# EasyEDA Pro project 3轴4.0控制板PCB源文件（LY-3X4.0-V2.0）.eprj, board LY-3axis-4.0-v2.0-
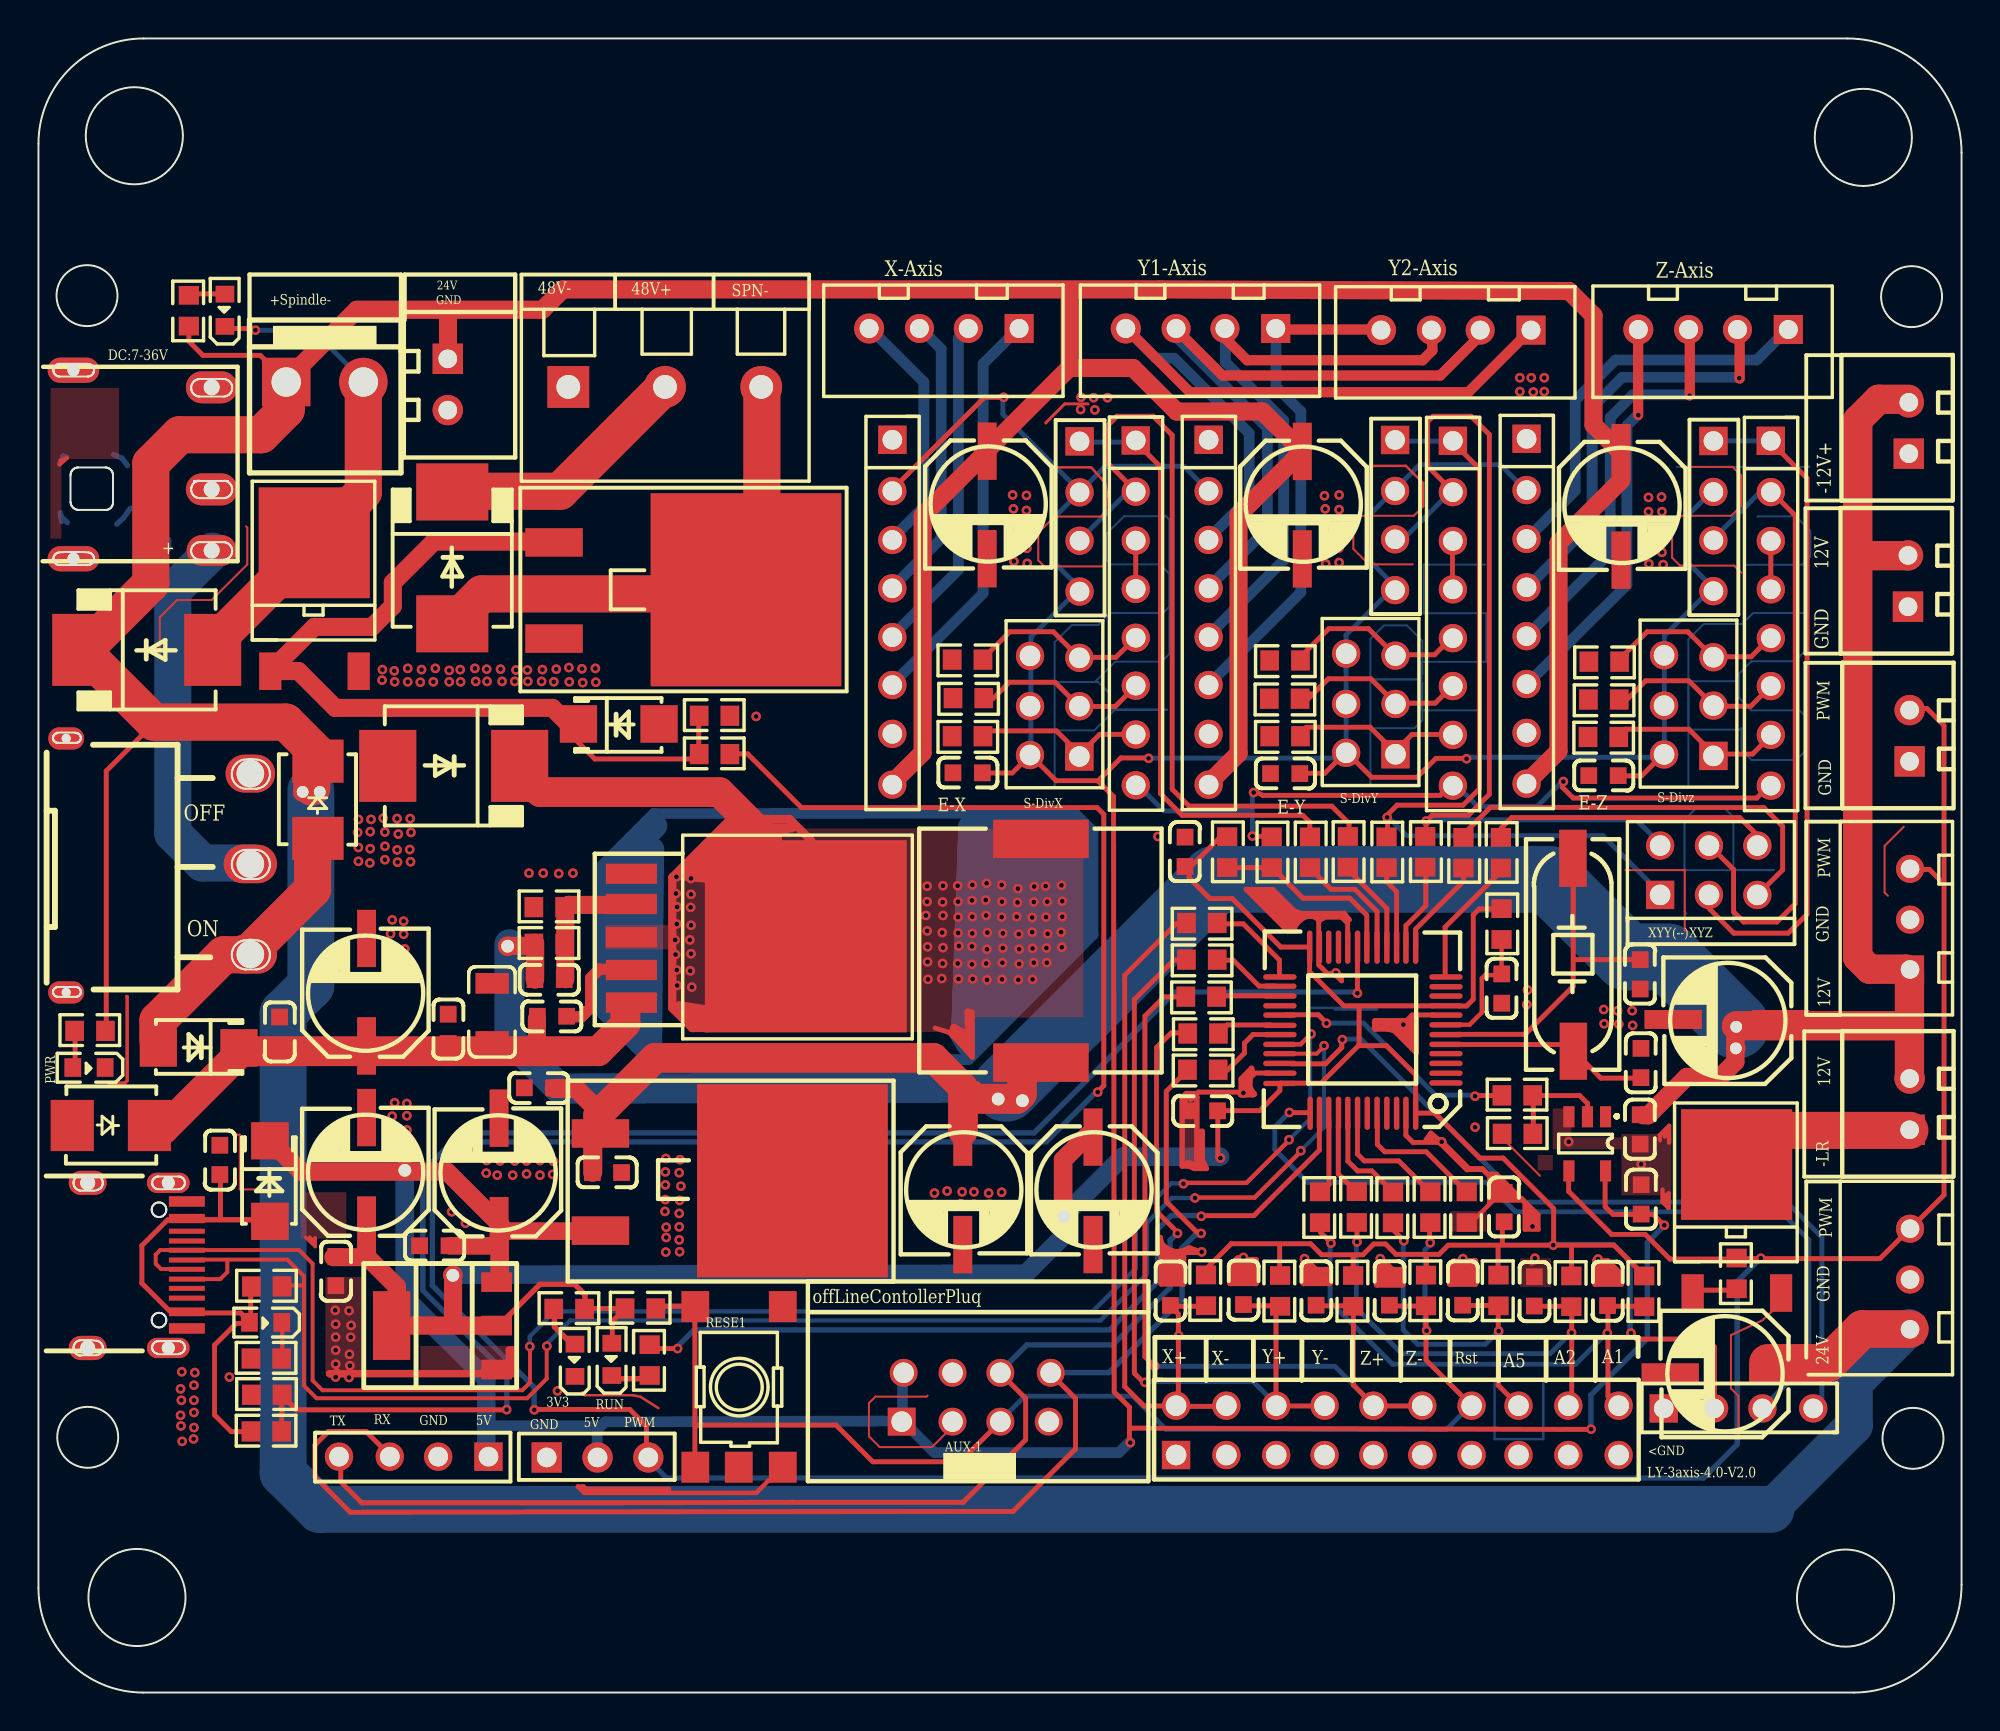
[diagram p0: board, top side]
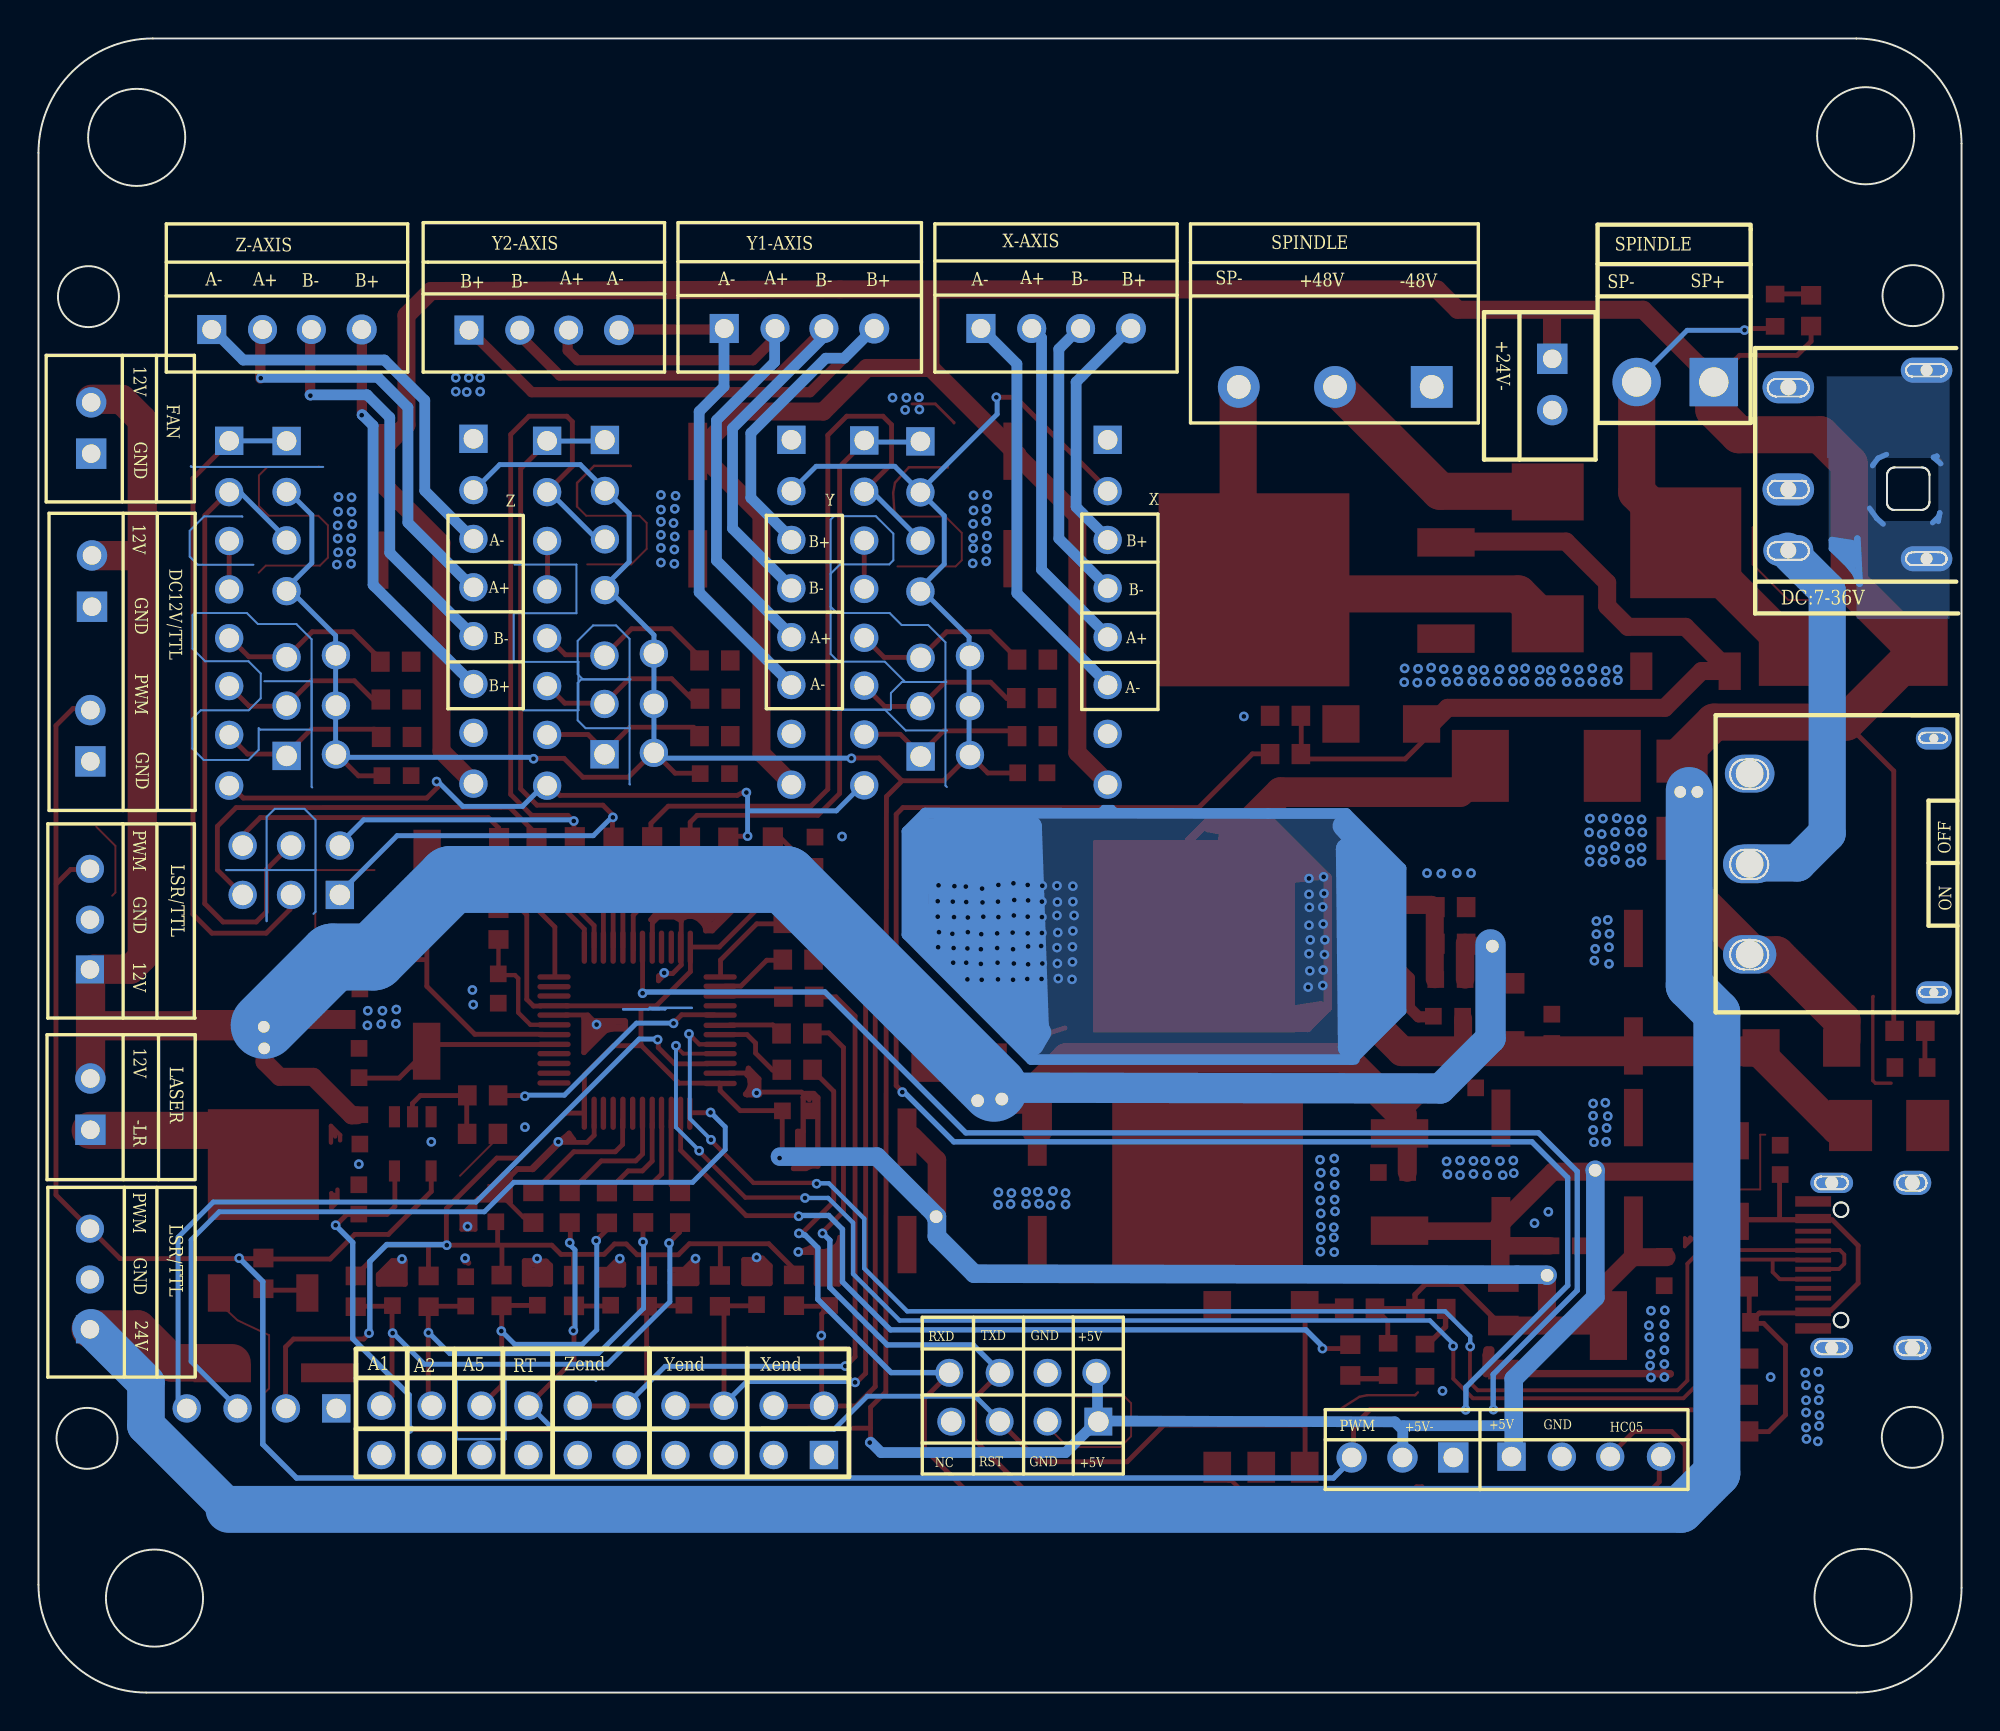
[diagram p1: board, bottom side, seen from below]

Outline 99.99 x 86.01 mm; copper layers: Top Layer, Bottom Layer. Coordinates in mm from the lower left corner of the outline.
Outline path: circle c2.52,72.64 r1.58 ; circle c2.56,13.27 r1.59 ; circle c4.98,80.95 r2.53 ; circle c5.12,4.94 r2.53 ; circle c6.27,25.11 r0.38 ; circle c6.27,19.36 r0.38 ; circle c93.96,4.91 r2.53 ; circle c94.88,80.87 r2.53 ; circle c97.39,72.59 r1.59 ; circle c97.47,13.22 r1.59 ; 0,80.54 arc(1.6,84.41) 5.47,86.01 94.04,86.01 arc(98.25,84.27) 99.99,80.06 99.99,5.6 arc(98.35,1.64) 94.39,0 5.44,0 arc(1.59,1.59) 0,5.44 0,80.54

## Placement (name value [footprint] x y rotation side)
NOREF  -  [Pad_ie8]  24.39 38.81 270 top
NOREF#2  -  [9]  97.31 24.12 0 top
NOREF#3  -  [9]  97.31 42.83 0 top
NOREF#4  -  [81]  81.48 29.94 0 top
NOREF#5  -  [8]  12.88 68.15 0 top
NOREF#6  -  [95]  9.01 67.87 0 top
NOREF#7  -  [76]  23.59 33.86 0 top
NOREF#8  -  [97]  11.02 47.78 0 top
NOREF#9  -  [Pad_ie10]  21.55 21.7 270 top
NOREF#10  -  [85]  12.03 24.5 0 top
NOREF#11  -  [85]  6.23 33.52 270 top
NOREF#12  -  [85]  32.27 50.37 90 top
NOREF#13  -  [88]  52.12 32.76 0 top
NOREF#14  -  [55]  73.18 31.7 0 top
NOREF#15  -  [82]  14.53 44.42 0 top
NOREF#16  -  [82]  1.76 29.48 270 top
NOREF#17  -  [2]  44.4 65.14 0 top
NOREF#18  -  [2]  57.05 65.11 0 top
NOREF#19  -  [2]  60.84 65.14 0 top
NOREF#20  -  [2]  73.54 65.09 0 top
NOREF#21  -  [2]  77.37 65.19 0 top
NOREF#22  -  [2]  90.07 65.09 0 top
NOREF#23  -  [83]  79.81 33.35 0 top
NOREF#24  -  [Pad_ie17]  14.63 46.83 270 top
NOREF#25  -  [6]  44.88 14.09 0 top
NOREF#26  -  [1]  84.51 14.77 180 top
NOREF#27  -  [1]  23.4 12.27 0 top
NOREF#28  -  [Pad_ie12]  88.25 33.5 270 top
NOREF#29  -  [4]  59.15 12.35 0 top
NOREF#30  -  [80]  12.67 21.11 0 top
NOREF#31  -  [80]  12.65 17.37 0 top
NOREF#32  -  [80]  12.67 15.48 0 top
NOREF#33  -  [80]  12.65 13.58 0 top
NOREF#34  -  [80]  28.39 19.95 0 top
NOREF#35  -  [80]  32.1 19.97 0 top
NOREF#36  -  [80]  31.78 18.09 90 top
NOREF#37  -  [80]  3.48 34.41 0 top
NOREF#38  -  [80]  27.36 38.94 0 top
NOREF#39  -  [80]  27.36 40.84 0 top
NOREF#40  -  [80]  35.95 50.79 0 top
NOREF#41  -  [80]  35.95 48.8 0 top
NOREF#42  -  [80]  7.82 72.65 90 top
NOREF#43  -  [80]  47.51 53.71 180 top
NOREF#44  -  [80]  47.55 51.71 180 top
NOREF#45  -  [80]  47.51 49.73 180 top
NOREF#46  -  [80]  64.02 53.67 180 top
NOREF#47  -  [80]  64 51.68 180 top
NOREF#48  -  [80]  64.02 49.73 180 top
NOREF#49  -  [80]  59.74 32.39 180 top
NOREF#50  -  [80]  59.75 34.27 180 top
NOREF#51  -  [80]  59.66 36.18 180 top
NOREF#52  -  [80]  59.69 38.11 180 top
NOREF#53  -  [80]  59.69 40.02 180 top
NOREF#54  -  [80]  61.81 42.91 270 top
NOREF#55  -  [80]  64.12 42.89 270 top
NOREF#56  -  [80]  66.11 42.89 270 top
NOREF#57  -  [80]  68.08 42.92 270 top
NOREF#58  -  [80]  70.09 42.89 270 top
NOREF#59  -  [80]  72.1 42.92 270 top
NOREF#60  -  [80]  74.09 42.87 270 top
NOREF#61  -  [80]  76.04 42.87 270 top
NOREF#62  -  [80]  76.07 39.16 270 top
NOREF#63  -  [80]  77.69 31.05 0 top
NOREF#64  -  [80]  77.7 29.05 0 top
NOREF#65  -  [80]  74.26 26.03 90 top
NOREF#66  -  [80]  72.37 26.03 90 top
NOREF#67  -  [80]  70.43 26.02 90 top
NOREF#68  -  [80]  68.55 26.05 90 top
NOREF#69  -  [80]  66.63 26.03 90 top
NOREF#70  -  [80]  60.71 21.72 90 top
NOREF#71  -  [80]  64.56 21.69 90 top
NOREF#72  -  [80]  68.36 21.69 90 top
NOREF#73  -  [80]  72.15 21.71 90 top
NOREF#74  -  [80]  75.91 21.71 90 top
NOREF#75  -  [80]  79.7 21.66 90 top
NOREF#76  -  [80]  83.49 21.66 90 top
NOREF#77  -  [80]  88.3 22.6 90 top
NOREF#78  -  [80]  80.57 49.69 180 top
NOREF#79  -  [80]  80.59 51.64 180 top
NOREF#80  -  [80]  80.61 53.6 180 top
NOREF#81  -  [77]  29.81 18.16 0 top
NOREF#82  -  [77]  27.9 18.12 0 top
NOREF#83  -  [77]  10.97 19.25 90 top
NOREF#84  -  [77]  1.79 32.5 90 top
NOREF#85  -  [77]  9.69 72.72 0 top
NOREF#86  -  [92]  29.22 29.07 0 top
NOREF#87  -  [94]  30.83 42.58 0 top
NOREF#88  -  [3]  84.24 41.48 270 top
NOREF#89  -  [5]  26.43 12.22 0 top
NOREF#90  -  [79]  27.46 35.17 0 top
NOREF#91  -  [79]  27.34 37.07 0 top
NOREF#92  -  [79]  26.79 31.44 0 top
NOREF#93  -  [79]  21.3 35.27 90 top
NOREF#94  -  [79]  12.54 35.13 90 top
NOREF#95  -  [79]  9.43 28.46 90 top
NOREF#96  -  [79]  15.46 22.68 90 top
NOREF#97  -  [79]  28.8 27.04 180 top
NOREF#98  -  [79]  19.82 23.23 180 top
NOREF#99  -  [79]  47.55 47.83 180 top
NOREF#100  -  [79]  64.06 47.78 180 top
NOREF#101  -  [79]  59.62 42.96 270 top
NOREF#102  -  [79]  80.61 47.68 180 top
NOREF#103  -  [79]  76.08 35.85 270 top
NOREF#104  -  [79]  83.28 36.59 270 top
NOREF#105  -  [79]  83.32 31.97 270 top
NOREF#106  -  [79]  83.28 28.52 270 top
NOREF#107  -  [79]  83.33 24.88 270 top
NOREF#108  -  [79]  76.21 24.48 270 top
NOREF#109  -  [79]  61.31 30.25 0 top
NOREF#110  -  [79]  58.85 21.65 90 top
NOREF#111  -  [79]  62.65 21.7 90 top
NOREF#112  -  [79]  66.43 21.66 90 top
NOREF#113  -  [79]  70.24 21.66 90 top
NOREF#114  -  [79]  74.05 21.66 90 top
NOREF#115  -  [79]  77.78 21.62 90 top
NOREF#116  -  [79]  81.59 21.64 90 top
NOREF#117  -  [Pad_ie14]  51.16 30.78 270 top
NOREF#118  -  [7]  21.28 66.69 0 top
NOREF#119  -  [7]  97.29 31.93 180 top
NOREF#120  -  [7]  97.29 51.09 180 top
NOREF#121  -  [7]  97.21 59.13 180 top
NOREF#122  -  [7]  97.25 67.09 180 top
NOREF#123  -  [93]  7.72 25.54 0 top
NOREF#124  -  [99]  83.18 70.88 0 top
NOREF#125  -  [99]  69.81 70.84 0 top
NOREF#126  -  [99]  56.54 70.93 0 top
NOREF#127  -  [99]  43.19 70.93 0 top
NOREF#128  -  [91]  26.81 59.81 0 top
NOREF#129  -  [98]  27.55 67.89 0 top
NOREF#130  -  [3#2]  87.09 48.7 0 top
NOREF#131  -  [3#2]  70.56 48.79 0 top
NOREF#132  -  [3#2]  54.12 48.67 0 top
NOREF#133  -  [86]  34.15 11.72 0 top
NOREF#134  -  [Pad_ie16]  13.74 46.83 270 top
NOREF#135  -  [87]  17.06 33.62 0 top
NOREF#136  -  [87]  23.95 24.28 0 top
NOREF#137  -  [87]  17.06 24.31 0 top
NOREF#138  -  [87]  48.06 28.88 180 top
NOREF#139  -  [87]  54.83 28.88 180 top
NOREF#140  -  [87]  90.43 16.63 90 top
NOREF#141  -  [87]  90.58 35 90 top
NOREF#142  -  [87]  82.29 64.47 180 top
NOREF#143  -  [87]  65.71 64.54 180 top
NOREF#144  -  [87]  49.33 64.55 180 top
NOREF#145  -  [90]  12.05 53.11 0 top
NOREF#146  -  [90]  86.01 20.78 0 top
NOREF#147  -  [Pad_ie9]  19.05 27.16 270 top
NOREF#148  -  [89]  9.06 54.22 90 top
NOREF#149  -  [89]  18.16 48.19 270 top
NOREF#150  -  [89]  21.52 55.57 0 top
NOREF#151  -  [Pad_ie11]  88.28 34.62 270 top
NOREF#152  -  [1]  87.09 65.05 90 top
NOREF#153  -  [1]  70.54 65.1 90 top
NOREF#154  -  [1]  54.13 65.02 90 top
NOREF#155  -  [Pad_ie15]  49.9 30.86 270 top
NOREF#156  -  [Pad_ie13]  53.32 24.74 270 top
NOREF#157  -  [84]  23.82 16.8 0 top

## Footprints (pads in the part's own frame, mm; a bottom-side part is the same pattern mirrored in y, then rotated)
1
  rect 1.473x1.473 hole 1.016: 1(0,0)
  round 1.473 hole 1.016: 2(-2.616,0) 3(-5.131,0) 4(-7.772,0)
2
  rect 1.473x1.473 hole 1.016: 1(0,0)
  round 1.473 hole 1.016: 2(0,-2.667) 3(0,-5.207) 4(0,-7.721) 5(0,-10.261) 6(0,-12.751) 7(0,-15.291) 8(0,-17.933)
3
  rect 1.473x1.473 hole 1.067: 1(0,0.076)
  round 1.473 hole 1.067: 2(-2.566,0.076) 3(0,2.616) 4(-2.566,2.616) 5(0,5.131) 6(-2.566,5.131)
3#2
  rect 1.473x1.473 hole 1.067: 1(0,0)
  round 1.473 hole 1.067: 2(-2.566,0.076) 3(0,2.616) 4(-2.566,2.616) 5(0,5.131) 6(-2.566,5.232)
4
  rect 1.473x1.473 hole 1.067: 1(0,0)
  round 1.473 hole 1.067: 2(0,2.566) 3(2.616,0) 4(2.616,2.566) 5(5.207,0) 6(5.207,2.566) 7(7.721,0) 8(7.721,2.566) 9(10.261,0) 10(10.261,2.566) 11(12.802,0) 12(12.802,2.566) 13(15.367,0) 14(15.367,2.566) 15(17.805,0) 16(17.805,2.566) 17(20.396,0) 18(20.396,2.566) 19(23.012,0) 20(23.012,2.566)
5
  rect 1.575x1.575 hole 1.016: 1(0,0)
  round 1.575 hole 1.016: 2(2.642,0) 3(5.283,0)
6
  rect 1.45x1.45 hole 1.067: 1(0,0)
  round 1.45 hole 1.067: 2(0.102,2.54) 3(2.642,0) 4(2.642,2.54) 5(5.131,0) 6(5.131,2.54) 7(7.646,0) 8(7.747,2.54)
7
  round 1.58 hole 0.965: 1(0,0)
  rect 1.58x1.58 hole 0.965: 2(0,2.667)
8
  rect 2.517x2.517 hole 1.524: 1(0,0)
  round 2.517 hole 1.524: 2(4.013,0)
9
  round 1.46 hole 0.96: 1(0,0) 2(0,-2.642)
  rect 1.46x1.46 hole 0.96: 3(0,-5.232)
55
  oval 1.731x0.28 smd: 1(0,0) 2(0,0.508) 3(0,1.016) 4(0,1.524) 5(0,2.006) 6(0,2.514) 7(0,3.022) 8(0,3.53) 9(0,4.013) 10(0,4.521) 11(0,5.004) 12(0,5.512) 25(-8.636,5.512) 26(-8.636,5.029) 27(-8.636,4.521) 28(-8.636,4.013) 29(-8.636,3.53) 30(-8.636,2.997) 31(-8.636,2.514) 32(-8.636,2.006) 33(-8.636,1.524) 34(-8.636,1.016) 35(-8.636,0.508) 36(-8.636,-0.025)
  oval 0.28x1.731 smd: 13(-1.575,7.061) 14(-2.083,7.061) 15(-2.566,7.061) 16(-3.074,7.061) 17(-3.582,7.061) 18(-4.115,7.061) 19(-4.598,7.061) 20(-5.106,7.061) 21(-5.588,7.061) 22(-6.096,7.061) 23(-6.579,7.061) 24(-7.087,7.061) 37(-7.061,-1.575) 38(-6.579,-1.575) 39(-6.096,-1.575) 40(-5.588,-1.575) 41(-5.106,-1.575) 42(-4.598,-1.575) 43(-4.09,-1.575) 44(-3.582,-1.575) 45(-3.074,-1.575) 46(-2.566,-1.575) 47(-2.083,-1.575) 48(-1.575,-1.575)
76
  rect 1.731x1.071 smd: 1(0,0) 2(0,3.022)
77
  rect 0.969x0.868 smd: 1(0,0) 2(0,-1.677)
79
  rect 0.868x0.868 smd: 1(0,0) 2(-1.524,0)
80
  rect 0.969x1.05 smd: 1(0,0) 2(-1.6,0)
81
  rect 0.578x1.1 smd: 1(0,0) 2(-0.94,0) 3(-1.905,0) 4(-1.905,-2.82) 5(0,-2.82)
82
  rect 2.66x2.239 smd: 1(0,0) 2(0,4.013)
83
  rect 1.427x2.965 smd: 1(0,0) 2(-0.025,10.033)
84
  rect 1.593x1.02 smd: 1(0,0) 2(0,2.286) 3(0,4.546)
  rect 1.935x3.575 smd: 4(-5.461,2.286)
85
  rect 1.949x1.935 smd: 1(0,0) 2(0,4.191)
86
  rect 1.441x1.609 smd: 1(0,0) 2(2.26,0) 3(4.546,0) 4(4.546,8.357) 5(0,8.357)
87
  rect 0.984x2.981 smd: 1(0,0) 2(0,5.588)
88
  rect 4.963x2 smd: 1(0,0) 2(0,11.633)
89
  rect 3.743x2.965 smd: 1(0,0) 2(0,6.858)
90
  rect 1.153x1.949 smd: 1(0,0) 3(4.598,0)
  rect 5.775x5.759 smd: 2(2.286,6.68)
91
  rect 2.984x1.479 smd: 1(0,0) 3(0,-5.004)
  rect 9.92x10.04 smd: 2(9.982,-2.464)
92
  rect 2.984x1.479 smd: 1(0,0) 3(0,-5.054)
  rect 9.92x10.04 smd: 2(9.982,-2.464)
93
  rect 1.867x0.545 smd: 1(0,0) 12(0,-6.604)
  rect 1.867x0.48 smd: 2(0,-0.889)
  rect 1.867x0.26 smd: 3(0,-1.55) 4(0,-2.058) 5(0,-2.54) 6(0,-3.048) 7(0,-3.53) 8(0,-4.038) 9(0,-4.521) 10(0,-5.029)
  rect 1.867x0.45 smd: 11(0,-5.74)
  oval 2.222x1.054 hole 0.675: 13(-0.965,0.965) 14(-0.965,-7.62)
  oval 1.968x1.257 hole 0.777: 15(-5.156,0.965) 16(-5.156,-7.62)
94
  rect 2.66x1.051 smd: 1(0,0) 2(0,-1.575) 3(0,-3.302) 4(0,-5.004) 5(0,-6.705)
  rect 10.5x10 smd: 6(9.068,-3.251)
95
  oval 2.679x1.663 hole 0.828: 1(0,0) 2(0,-5.309)
  oval 2.6x1.6 hole 0.828: 3(0,-8.483)
  oval 2.679x1.308 hole 0.625: 6(-7.188,0.889) 7(-7.188,-8.915)
97
  oval 2.578x1.968 hole 1.437: 1(0,0)
  oval 2.77x2 hole 1.437: 2(0,-4.699) 3(0,-9.398)
  oval 1.867x1.155 hole 0.472: 4(-9.576,1.829) 5(-9.576,-11.379)
98
  rect 2.171x2.171 hole 1.234: 1(0,0)
  round 2.171 hole 1.234: 2(5.029,0) 3(10.033,0)
99
  round 1.562 hole 0.98: 1(0,0)
  round 1.511 hole 0.98: 2(2.616,0) 3(5.156,0)
  rect 1.511x1.511 hole 0.98: 4(7.798,0)
Pad_ie8
  round 1.02 hole 0.66: 49(0,0)
Pad_ie9
  round 1.02 hole 0.66: 50(0,0)
Pad_ie10
  round 1.02 hole 0.66: 51(0,0)
Pad_ie11
  round 1.02 hole 0.61: 52(0,0)
Pad_ie12
  round 1.02 hole 0.61: 53(0,0)
Pad_ie13
  round 1.02 hole 0.66: 54(0,0)
Pad_ie14
  round 1.02 hole 0.66: 55(0,0)
Pad_ie15
  round 1.02 hole 0.66: 56(0,0)
Pad_ie16
  round 1.02 hole 0.61: 57(0,0)
Pad_ie17
  round 1.02 hole 0.61: 58(0,0)

## Nets
UNNAMEDNET1: NOREF#25.6 NOREF#27.4 NOREF#50.1
UNNAMEDNET2: NOREF#25.8 NOREF#27.3 NOREF#49.1
UNNAMEDNET3: NOREF#2.2 NOREF#3.2 NOREF#4.3 NOREF#6.1 NOREF#6.2 NOREF#6.6 NOREF#6.7 NOREF#7.2 NOREF#12.1 NOREF#14.8 NOREF#14.20 NOREF#14.23 NOREF#14.35 NOREF#14.47 NOREF#16.1 NOREF#17.1 NOREF#17.7 NOREF#19.1 NOREF#19.7 NOREF#21.1 NOREF#21.7 NOREF#25.3 NOREF#25.4 NOREF#26.1 NOREF#27.2 NOREF#29.1 NOREF#29.3 NOREF#29.5 NOREF#29.7 NOREF#29.9 NOREF#29.11 NOREF#29.13 NOREF#29.15 NOREF#29.17 NOREF#29.19 NOREF#31.2 NOREF#32.2 NOREF#39.2 NOREF#40.1 NOREF#43.1 NOREF#44.1 NOREF#45.1 NOREF#46.1 NOREF#47.1 NOREF#48.1 NOREF#64.2 NOREF#65.2 NOREF#78.1 NOREF#79.1 NOREF#80.1 NOREF#82.2 NOREF#84.2 NOREF#86.2 NOREF#87.1 NOREF#89.1 NOREF#92.2 NOREF#93.1 NOREF#94.1 NOREF#95.1 NOREF#96.2 NOREF#97.2 NOREF#98.1 NOREF#99.1 NOREF#100.1 NOREF#101.2 NOREF#102.1 NOREF#103.1 NOREF#104.1 NOREF#105.2 NOREF#106.1 NOREF#107.2 NOREF#108.2 NOREF#109.2 NOREF#110.1 NOREF#111.1 NOREF#112.1 NOREF#113.1 NOREF#114.1 NOREF#115.1 NOREF#116.1 NOREF#118.1 NOREF#120.2 NOREF#121.2 NOREF#122.2 NOREF#123.1 NOREF#123.12 NOREF#123.13 NOREF#123.14 NOREF#123.15 NOREF#123.16 NOREF#128.3 NOREF#129.1 NOREF#133.3 NOREF#133.4 NOREF#135.2 NOREF#136.2 NOREF#137.2 NOREF#138.2 NOREF#139.2 NOREF#140.2 NOREF#141.2 NOREF#142.2 NOREF#143.2 NOREF#144.2 NOREF#145.3 NOREF#146.3 NOREF#149.1 NOREF#157.1
UNNAMEDNET4: NOREF#4.5 NOREF#10.2 NOREF#17.2 NOREF#19.2 NOREF#21.2 NOREF#25.1 NOREF#25.2 NOREF#27.1 NOREF#86.3 NOREF#89.2 NOREF#98.2 NOREF#99.2 NOREF#100.2 NOREF#102.2 NOREF#107.1 NOREF#130.2 NOREF#130.4 NOREF#130.6 NOREF#131.2 NOREF#131.4 NOREF#131.6 NOREF#132.2 NOREF#132.4 NOREF#132.6 NOREF#136.1 NOREF#147.50 NOREF#152.2 NOREF#152.4 NOREF#153.2 NOREF#153.4 NOREF#154.2 NOREF#154.4 NOREF#157.3
UNNAMEDNET5: NOREF#14.34 NOREF#26.4
UNNAMEDNET6: NOREF#14.37 NOREF#26.3
UNNAMEDNET7: NOREF#9.51 NOREF#14.9 NOREF#14.24 NOREF#14.36 NOREF#14.48 NOREF#26.2 NOREF#34.1 NOREF#35.2 NOREF#54.2 NOREF#62.2 NOREF#70.1 NOREF#71.1 NOREF#72.1 NOREF#73.1 NOREF#74.1 NOREF#75.1 NOREF#76.1 NOREF#81.1 NOREF#96.1 NOREF#101.1 NOREF#108.1 NOREF#109.1 NOREF#137.1 NOREF#139.1 NOREF#156.54 NOREF#157.2 NOREF#157.4
UNNAMEDNET8: NOREF#2.1 NOREF#3.1 NOREF#4.4 NOREF#41.1 NOREF#77.1 NOREF#89.3 NOREF#120.1
UNNAMEDNET9: NOREF#22.2 NOREF#88.4 NOREF#152.3
UNNAMEDNET10: NOREF#22.1 NOREF#88.3 NOREF#152.1
UNNAMEDNET11: NOREF#20.2 NOREF#59.2 NOREF#88.2 NOREF#153.3
UNNAMEDNET12: NOREF#20.1 NOREF#58.2 NOREF#88.1 NOREF#153.1
UNNAMEDNET13: NOREF#18.2 NOREF#57.2 NOREF#154.3
UNNAMEDNET14: NOREF#18.1 NOREF#56.2 NOREF#154.1
UNNAMEDNET15: NOREF#2.3 NOREF#5.1 NOREF#15.2 NOREF#17.8 NOREF#19.8 NOREF#21.8 NOREF#24.58 NOREF#37.1 NOREF#42.2 NOREF#118.2 NOREF#134.57 NOREF#140.1 NOREF#142.1 NOREF#143.1 NOREF#144.1 NOREF#148.2
UNNAMEDNET16: NOREF#17.3 NOREF#127.1
UNNAMEDNET17: NOREF#17.4 NOREF#127.2
UNNAMEDNET18: NOREF#17.5 NOREF#127.3
UNNAMEDNET19: NOREF#17.6 NOREF#127.4
UNNAMEDNET20: NOREF#18.8 NOREF#20.8 NOREF#22.8 NOREF#55.2
UNNAMEDNET21: NOREF#18.3 NOREF#18.4
UNNAMEDNET22: NOREF#18.5 NOREF#43.2 NOREF#132.5
UNNAMEDNET23: NOREF#18.6 NOREF#44.2 NOREF#132.3
UNNAMEDNET24: NOREF#18.7 NOREF#45.2 NOREF#132.1
UNNAMEDNET25: NOREF#19.3 NOREF#125.4 NOREF#126.1
UNNAMEDNET26: NOREF#19.4 NOREF#125.3 NOREF#126.2
UNNAMEDNET27: NOREF#19.5 NOREF#125.2 NOREF#126.3
UNNAMEDNET28: NOREF#19.6 NOREF#125.1 NOREF#126.4
UNNAMEDNET29: NOREF#20.3 NOREF#20.4
UNNAMEDNET30: NOREF#20.5 NOREF#46.2 NOREF#131.5
UNNAMEDNET31: NOREF#20.6 NOREF#47.2 NOREF#131.3
UNNAMEDNET32: NOREF#20.7 NOREF#48.2 NOREF#131.1
UNNAMEDNET33: NOREF#21.3 NOREF#124.4
UNNAMEDNET34: NOREF#21.4 NOREF#124.3
UNNAMEDNET35: NOREF#21.5 NOREF#124.2
UNNAMEDNET36: NOREF#21.6 NOREF#124.1
UNNAMEDNET37: NOREF#22.3 NOREF#22.4
UNNAMEDNET38: NOREF#22.5 NOREF#80.2 NOREF#130.5
UNNAMEDNET39: NOREF#22.6 NOREF#79.2 NOREF#130.3
UNNAMEDNET40: NOREF#22.7 NOREF#78.2 NOREF#130.1
UNNAMEDNET41: NOREF#60.2 NOREF#88.5
UNNAMEDNET42: NOREF#61.2 NOREF#88.6
UNNAMEDNET43: NOREF#29.2 NOREF#29.4 NOREF#53.1 NOREF#70.2 NOREF#110.2
UNNAMEDNET44: NOREF#29.6 NOREF#29.8 NOREF#52.1 NOREF#71.2 NOREF#111.2
UNNAMEDNET45: NOREF#29.10 NOREF#29.12 NOREF#51.1 NOREF#72.2 NOREF#112.2
UNNAMEDNET46: NOREF#25.5 NOREF#29.14 NOREF#35.1 NOREF#66.2 NOREF#73.2 NOREF#113.2 NOREF#133.1 NOREF#133.5
UNNAMEDNET47: NOREF#29.16 NOREF#67.2 NOREF#74.2 NOREF#114.2
UNNAMEDNET48: NOREF#29.18 NOREF#68.2 NOREF#75.2 NOREF#115.2
UNNAMEDNET49: NOREF#29.20 NOREF#69.2 NOREF#76.2 NOREF#116.2
UNNAMEDNET50: NOREF#25.7
UNNAMEDNET51: NOREF#119.2 NOREF#146.2
UNNAMEDNET52: NOREF.49 NOREF#3.3 NOREF#13.1 NOREF#28.53 NOREF#38.2 NOREF#86.1 NOREF#91.2 NOREF#92.1 NOREF#97.1 NOREF#106.2 NOREF#117.55 NOREF#119.1 NOREF#121.1 NOREF#122.1 NOREF#138.1 NOREF#141.1 NOREF#151.52 NOREF#155.56
UNNAMEDNET53: NOREF#5.2 NOREF#85.2 NOREF#145.2 NOREF#148.1
UNNAMEDNET54: NOREF#128.2 NOREF#129.3 NOREF#150.1
UNNAMEDNET55: NOREF#129.2 NOREF#150.2
UNNAMEDNET56: NOREF#8.1
UNNAMEDNET57: NOREF#6.3 NOREF#8.2
UNNAMEDNET58: NOREF#8.3 NOREF#11.1 NOREF#15.1
UNNAMEDNET59: NOREF#8.4
UNNAMEDNET60: NOREF#8.5
UNNAMEDNET61: NOREF#10.1 NOREF#30.2 NOREF#33.2 NOREF#83.1 NOREF#95.2 NOREF#123.2 NOREF#123.11
UNNAMEDNET62: NOREF#123.3
UNNAMEDNET63: NOREF#123.4
UNNAMEDNET64: NOREF#14.32 NOREF#123.5 NOREF#123.7
UNNAMEDNET65: NOREF#14.33 NOREF#30.1 NOREF#123.6 NOREF#123.8
UNNAMEDNET66: NOREF#123.9
UNNAMEDNET67: NOREF#123.10
UNNAMEDNET68: NOREF#13.2 NOREF#87.3 NOREF#87.6 NOREF#149.2
UNNAMEDNET69: NOREF#7.1 NOREF#11.2 NOREF#16.2 NOREF#87.5 NOREF#90.2 NOREF#93.2 NOREF#94.2 NOREF#135.1
UNNAMEDNET70: NOREF#87.4 NOREF#90.1
UNNAMEDNET71: NOREF#38.1 NOREF#39.1 NOREF#87.2 NOREF#91.1
UNNAMEDNET72: NOREF#12.2 NOREF#40.2 NOREF#41.2 NOREF#128.1 NOREF#145.1
UNNAMEDNET73: NOREF#77.2 NOREF#146.1
UNNAMEDNET74: NOREF#133.2
UNNAMEDNET75: NOREF#14.5 NOREF#23.1 NOREF#105.1
UNNAMEDNET76: NOREF#14.6 NOREF#23.2 NOREF#104.2
UNNAMEDNET77: NOREF#4.1
UNNAMEDNET78: NOREF#4.2 NOREF#63.1 NOREF#64.1
UNNAMEDNET79: NOREF#31.1 NOREF#83.2
UNNAMEDNET80: NOREF#14.19 NOREF#32.1 NOREF#33.1
UNNAMEDNET81: NOREF#34.2 NOREF#82.1
UNNAMEDNET82: NOREF#14.38 NOREF#36.1
UNNAMEDNET83: NOREF#36.2 NOREF#81.2
UNNAMEDNET84: NOREF#37.2 NOREF#84.1
UNNAMEDNET85: NOREF#42.1 NOREF#85.1
UNNAMEDNET86: NOREF#14.31 NOREF#49.2
UNNAMEDNET87: NOREF#14.30 NOREF#50.2
UNNAMEDNET88: NOREF#14.27 NOREF#51.2
UNNAMEDNET89: NOREF#14.26 NOREF#52.2
UNNAMEDNET90: NOREF#14.25 NOREF#53.2
UNNAMEDNET91: NOREF#14.18 NOREF#54.1 NOREF#55.1
UNNAMEDNET92: NOREF#14.17 NOREF#56.1
UNNAMEDNET93: NOREF#14.16 NOREF#57.1
UNNAMEDNET94: NOREF#14.15 NOREF#58.1
UNNAMEDNET95: NOREF#14.14 NOREF#59.1
UNNAMEDNET96: NOREF#14.13 NOREF#60.1
UNNAMEDNET97: NOREF#14.12 NOREF#61.1
UNNAMEDNET98: NOREF#14.7 NOREF#62.1 NOREF#103.2
UNNAMEDNET99: NOREF#14.29 NOREF#63.2
UNNAMEDNET100: NOREF#14.44 NOREF#65.1
UNNAMEDNET101: NOREF#14.42 NOREF#66.1
UNNAMEDNET102: NOREF#14.41 NOREF#67.1
UNNAMEDNET103: NOREF#14.40 NOREF#68.1
UNNAMEDNET104: NOREF#14.39 NOREF#69.1
UNNAMEDNET105: NOREF#14.1
UNNAMEDNET106: NOREF#14.2
UNNAMEDNET107: NOREF#14.3
UNNAMEDNET108: NOREF#14.4
UNNAMEDNET109: NOREF#14.10
UNNAMEDNET110: NOREF#14.11
UNNAMEDNET111: NOREF#14.21
UNNAMEDNET112: NOREF#14.22
UNNAMEDNET113: NOREF#14.28
UNNAMEDNET114: NOREF#14.43
UNNAMEDNET115: NOREF#14.45
UNNAMEDNET116: NOREF#14.46

## Via types
v1: diameter 0.5, hole 0.25, Top Layer to Bottom Layer, 347 vias

## Routing (per net, layer and track width the routed paths; a pad name or vN(x,y) marks a point on that pad's centre or on a via; arc(x,y) is an arc through that point)
(no net): length 1.8
  Top Layer w0.174: 13.89,23.67 14.39,23.19 14.39,23.64 14.31,23.59 14.3,23.4 14.1,23.67 14.13,23.67
UNNAMEDNET1: length 67.6
  Top Layer w0.253: 49.95,16.44 50.19,16.44 51.33,15.29 51.33,13.14 48.08,9.9 39.21,9.9 29.74,9.86 16.81,9.86 15.72,10.95 15.72,11.9 ; 59.44,34.3 58.9,34.3 58.13,33.54 58.13,25.02 59.3,23.86
  Bottom Layer w0.278: 50.09,16.77 51.39,18.08 55.86,18.08 58.84,21.06 58.84,23.52 59.16,23.83 59.16,23.87
  vias: v1(59.22,23.88)
UNNAMEDNET2: length 73.3
  Top Layer w0.253: 18.16,12.57 18.03,12.57 17.03,13.58 15.08,13.58 14.37,12.87 14.37,11.22 16.21,9.38 50.28,9.42 50.67,9.42 53.92,12.67 53.92,15.29 52.81,16.4 ; 59.61,32.23 58.64,31.26 58.64,25.53 60.22,23.95 60.42,23.95
  Bottom Layer w0.278: 53.1,16.64 55.66,16.64 59.47,20.45 59.47,23.12 60.13,23.79 60.2,23.79 60.29,23.89
  vias: v1(60.45,23.88)
UNNAMEDNET3: length 503.2
  Top Layer w0.1: 96.99,45.02 95.99,44.03 95.99,41.6 96.16,41.43 ; 47.49,13.79 46.46,12.76 43.74,12.76 43.18,13.32 43.18,15.05 43.52,15.39 46.17,15.39 46.23,15.44 ; 85.42,63.76 85.45,63.73 88.08,63.73 88.53,63.29 88.53,61.7 88.02,61.19 85.44,61.19 84.94,60.7 84.94,59.01 85.35,58.6 88.17,58.6 88.54,58.23 ; 85.63,39.59 85.6,39.62 85.6,42.79 85.58,42.77 82.52,42.77 ; 71.46,58.66 69.17,58.66 68.37,59.47 68.37,60.82 68.74,61.19 71.51,61.19 71.99,61.67 ; 10.8,60.64 10.86,60.58 10.86,58.66 9.01,56.81 7.21,56.81 6.31,55.91 6.31,53.99 ; 55.33,58.56 52.3,58.56 51.98,58.88 51.98,60.3 52.83,61.15 55.26,61.15 55.27,61.16 ; 11.62,26.16 10.47,26.16 10.47,29.01 10.2,29.01 ; 88.4,13.38 88.39,13.39 88.39,15.42 88,15.81 88,18.58 89.64,19.36 90.4,20.07 ; 76.04,28.78 76.17,28.78 78.07,26.87
  Top Layer w0.126: 55.27,61.16 55.49,61.43 55.55,62.38 55.46,62.91 54.74,63.71 52.72,63.71 52.7,63.7 ; 28.27,15.61 28.42,15.46 30.9,15.46 31.31,15.38 32.24,14.78 ; 69.19,63.78 69.2,63.79 71.1,63.79 71.99,62.9 71.99,61.67
  Top Layer w0.149: 52.39,66.01 52.39,66.04 53.36,67.01 54.57,67.01
  Top Layer w0.174: 3.66,31.69 4.48,31.69 4.61,31.82 4.61,36.17 4.59,36.2
  Top Layer w0.2: 1.12,64.07 1.48,64.19 1.3,64.05 1.1,63.85
  Top Layer w0.202: 58.33,23.26 58.35,23.7 58.47,23.2 ; 59.02,21.65 59.34,21.37
  Top Layer w0.227: 74.7,24.71 74.77,24.71 75.88,25.82 ; 75.49,26.84 75.44,26.84 75.44,25.5 75.53,25.59 77.19,25.59 75.82,26.97 75.37,26.97 ; 84.56,28.91 84.67,29.23 ; 84.44,26.15 84.44,25.52 84.76,25.2 84.76,25.96 84.7,25.86 84.66,25.5 84.59,25.88 ; 84.31,28.71 84.31,28.99 84.78,29.46 84.78,28.6 ; 38.11,11.02 37.95,11.02 37.32,10.38 28.37,10.38 28.05,10.71 28.34,10.71 28.53,10.52 32.78,10.52 32.78,10.59 28.42,10.59 ; 76.97,25.71 77.12,25.71 77.99,24.84 77.99,24.08 77.28,24.08 77.28,25.46 77.53,25.06 ; 75.78,25.76 75.78,26.37 75.78,26.1 75.85,25.88 76.33,25.96 76.05,26.24 75.73,26.59 75.58,26.53 75.62,25.73 76.01,25.82 76.95,25.65 75.7,26.9 75.89,26.63 75.58,26.83
  Top Layer w0.253: 70.87,34.67 71.43,35.23 72.59,35.23 ; 71.1,29.53 71.1,28.98 71.47,28.61 72.95,28.61 72.72,28.82 72.4,29.09 72.16,28.75 72.54,28.78 72.64,28.77 72.38,28.89 ; 68.07,39.21 68.07,40 67.74,40.33 ; 66.45,40.26 66.26,40.35 65.98,40.35 65.7,40.24 65.44,39.98 65.33,39.8 65.3,39.6 64.95,39.6 62.79,41.76 64.18,41.76 65.28,40.66 65.55,40.55 ; 62.59,31.22 60.31,31.22 59.91,30.82 ; 62.99,32.22 64.06,32.22 ; 66.56,40.11 66.81,40.27 66.87,40.32 67.81,40.32 68.16,40.19 67.89,40.52 65.21,40.52 ; 67.53,37.3 67.71,37.3 67.75,37.25 67.75,37.01 67.37,37.39 67.01,37.39 66.57,37.84 66.57,40.31 ; 65.35,40.42 66.92,40.42 ; 66.95,40.43 67.73,40.43
  Top Layer w0.278: 60.16,31.15 59.68,31.15 59.47,30.94 59.47,27.38 59.82,27.38 60.09,27.25 60.73,27.25 60.52,27.69 60.52,29.18 60.23,29.18 60.23,30.96 59.63,30.96 59.63,30.71 ; 59.72,27.55 59.89,27.53 60.13,27.43 ; 62.88,31.31 62.83,31.31 62.74,31.36 62.73,31.51 62.86,32.1 62.76,31.88 62.65,31.54 62.77,31.21 62.54,31.17 62.54,31.91 63.08,32.46 63.15,32.12 63.03,32.01 62.98,31.76 62.98,31.53 63.11,31.25 63.22,31.11 63.15,31.08 62.52,31.08 62.48,31.11 ; 75.65,26.66 75.09,27.22 75.06,27.22 ; 60.23,29.09 60.23,27.71 60.34,27.39 60.39,27.39 60.39,27.83 60.29,29.05 ; 71.36,35.08 71.63,35.08 71.63,33.28 70.44,34.47 70.08,34.53 70.51,34.42
  Top Layer w0.303: 77.83,22.41 77.84,22.57 77.64,22.34 ; 62.62,22.57 62.36,22.57 61.97,22.18 61.97,21.28 63.3,21.28 63.3,22.5 62.65,22.5 62.31,22.31 62.09,21.81 62.22,21.46 63.05,21.52 63.08,22.27 62.52,22.16 62.45,22.13 62.6,22.17 ; 74.23,22.44 74.71,22.44 74.71,21.25 73.38,21.25 73.38,22.2 73.6,22.42 74.06,22.42 ; 81.65,21.67 81.34,22.07 81.29,22.38 81.87,21.92 82.08,21.5 81.14,21.55 81.12,22.44 81.59,22.44 82.3,21.73 82.3,21.25 80.94,21.25 80.94,22.46 81.09,22.46 ; 74.32,27.22 75.06,27.22 ; 74.13,22.25 74.46,22.24 74.43,21.55 73.64,21.48 73.56,22 73.85,22.26 73.99,22.15 74.17,21.78 74.43,21.4 74.07,21.59 ; 58.62,22.91 58.68,22.69 59.23,22.72 ; 66.53,21.82 66.53,21.88 65.83,22.57 65.78,22.57 65.78,21.28 67.14,21.28 67.14,21.98 66.01,21.98 65.98,22.25 65.99,21.8 66.95,21.69 66.92,21.54 66.61,21.43 66.04,21.51 66.02,21.7 ; 59.53,22.87 59.53,21.26 58.39,21.26 58.39,23.36 58.46,23.24 58.73,23.05 58.97,22.94 59.17,22.9 59.51,22.96 59.86,23.1 60.1,23 60.44,22.9 59.61,22.9 ; 69.8,22.44 69.74,22.44 69.59,22.28 69.59,21.21 70.92,21.21 70.92,21.98 70.39,21.98 69.86,22.51 69.83,22.3 69.83,21.38 70.69,21.41 70.73,21.67 70.72,21.73 70.16,21.63 70.14,21.66 69.92,22.14
  Top Layer w0.329: 74.28,27.25 74.32,27.22
  Top Layer w0.354: 70,34.58 71.06,34.58 71.06,34.54 69.51,34.54 69.51,34.89 71.19,34.89 71.19,34.85 ; 70.6,34.51 71.38,33.68 71.39,34.89 71.1,34.8 70.48,34.61 71.19,34.21 71.16,34.69 70.99,34.65 ; 65.12,40.5 65.46,40.34 65.02,39.79 63.16,41.56 64.08,41.56 65.09,40.46 65.18,40.15 63.6,41.25 63.81,41.33 64.39,40.98 64.57,40.75 ; 77.53,25.06 77.81,24.67 77.77,24.16 77.47,24.25 77.51,24.84 77.6,24.45
  Top Layer w0.38: 15.37,16.44 15.52,16.69 ; 72.82,28.67 72.87,28.67 74.28,27.25 ; 24.48,16.82 24.48,17.81 24.67,17.81 24.72,17.54 24.72,16.58 16.17,16.58 ; 15.38,16.58 15.14,16.57 16.21,16.57 16.16,16.4
  Top Layer w0.532: 58.71,22.5 59.13,22.57
  Top Layer w0.557: 59.13,22.57 59.15,21.63 58.7,21.67 58.58,22.29 58.89,21.95 59.17,21.64
  Bottom Layer w0.1: 85.69,40.49 85.59,40.6 85.59,45.38 86.16,45.95 87.7,45.95 88.11,45.55 88.13,45.53 88.13,40.11 88.13,42.77 90.22,42.77 85.57,42.77 ; 85.76,47.06 85.79,47.1 85.79,54.77 86.58,55.56 88.58,55.56 89.15,56.13 91.87,56.13 91.98,56.03 91.98,54.28 91.32,53.63 89.07,53.63 88.43,52.99 88.43,51.7 89.02,51.12 89.06,51.08 91.56,51.08 91.99,50.64 91.99,49.09 91.4,48.49 89.07,48.49 88.54,49.02 88.54,50.14 88.47,50.07 85.77,50.07 85.79,50.09 85.79,52.59 88.24,52.59 ; 89.39,61.14 89.41,61.16 91.38,61.16 92.13,60.41 92.13,59.07 91.7,58.64 88.82,58.64 ; 52.76,47.09 52.83,47.16 52.83,54.61 53.73,55.51 55.11,55.51 55.73,56.13 58.47,56.13 58.8,56.46 58.8,58.18 58.31,58.66 55.75,58.66 55.54,58.88 55.54,60.26 56.45,61.17 58.62,61.17 58.8,60.99 58.8,54.01 58.4,53.6 55.99,53.6 54.93,52.55 52.79,52.55 55.1,52.55 55.67,51.97 55.67,51.14 55.7,51.11 58.67,51.11 55.98,51.11 54.9,50.03 52.75,50.03 ; 75.24,58.65 72.02,58.65 72.02,56.12 75.28,56.12 75.28,53.59 71.91,53.59 71.91,51.08 74.78,51.08 74.82,51.12 ; 69.24,50.14 71.54,50.14 71.96,50.56 71.96,52.49 71.77,52.68 69.21,52.68 71.68,52.68 71.96,52.96 71.96,54.68 71.15,55.49 69.96,55.49 69.26,54.79 69.26,47.23 69.24,47.21 ; 85.18,63.73 92.03,63.73 92.06,63.76 92.08,63.75
  Bottom Layer w0.124: 78.27,16.3 78.24,16.3 78.24,13.18 75.71,13.18 75.71,16.22
  Bottom Layer w0.126: 68.07,35.53 67.42,35.53 67.39,35.55 67.68,35.55 ; 66.02,35.6 68.2,35.6 68.27,35.53 69.59,35.53 67.71,35.53
  Bottom Layer w0.149: 71,16.22 71.08,16.3 78.27,16.3
  Bottom Layer w0.278: 1.27,64.27 1.28,64.29 1.46,64.23 1.08,63.9 ; 1.5,60.83 1.19,61.15 1.13,61.34 1.21,60.9 ; 4.78,61.58 4.41,61.07 4.07,60.76 ; 3.91,64.38 4.34,64.19 4.59,63.85 4.62,63.8
  Bottom Layer w0.354: 5.42,60.01 5.3,57.67 5.51,58.2 5.88,58.66 6.73,59.49 6.73,59.92 5.72,59.76 5.55,58.67 6.55,59.59 6.44,59.62 5.92,59.4 5.76,59.01 6.06,59.69
  vias: v1(7.45,16.68) v1(7.39,15.79) v1(7.43,15.2) v1(7.39,14.41) v1(7.41,13.86) v1(7.47,13.06) v1(8.06,13.19) v1(8.13,16.64) v1(8.09,15.98) v1(8.09,15.2) v1(8.09,14.56) v1(8.09,13.78) v1(9.93,16.4) v1(15.43,19.88) v1(15.45,19.16) v1(15.45,18.48) v1(15.45,17.8) v1(15.45,17.08) v1(15.45,16.4) v1(16.15,19.85) v1(16.15,16.38) v1(16.26,19.09) v1(16.23,18.48) v1(16.17,17.59) v1(16.19,17) v1(16.64,45.4) v1(16.59,44.72) v1(16.64,43.94) v1(16.64,43.22) v1(17.25,44.77) v1(17.25,43.88) v1(17.23,43.14) v1(17.29,45.4) v1(17.86,52.64) v1(17.89,53.19) v1(17.93,45.47) v1(18.01,44.75) v1(18.01,44.01) v1(18.01,43.31) v1(18.31,39.45) v1(18.33,38.76) v1(18.33,37.89) v1(18.39,40.17) v1(18.39,29.97) v1(18.46,29.36) v1(18.5,53.13) v1(18.52,52.56) v1(18.52,30.67) v1(18.48,28.64) v1(18.65,45.45) v1(18.65,43.81) v1(18.71,44.64) v1(18.67,43.18) v1(18.99,40.11) v1(18.99,39.43) v1(19.05,38.67) v1(19.09,38.06) v1(19.16,30.63) v1(19.16,29.99) v1(19.16,29.25) v1(19.11,28.62) v1(19.2,53.26) v1(19.2,52.56) v1(19.33,45.45) v1(19.3,43.84) v1(19.35,43.2) v1(19.37,44.72) v1(19.85,52.54) v1(19.92,53.19) v1(20.53,52.56) v1(20.64,53.26) v1(21.36,53.15) v1(21.36,52.56) v1(21.48,25) v1(21.93,53.19) v1(21.95,52.56) v1(22.2,24.41) v1(22.69,53.26) v1(22.73,52.58) v1(23.3,53.21) v1(23.33,52.58) v1(23.3,27.67) v1(23.28,27.01) v1(23.85,26.9) v1(24.02,53.21) v1(24,27.64) v1(24.11,52.58) v1(24.66,26.9) v1(24.77,52.58) v1(24.77,27.64) v1(24.83,53.17) v1(25.42,53.17) v1(25.44,52.58) v1(25.38,27.64) v1(25.38,26.97) v1(25.51,42.61) v1(26.16,52.58) v1(26.08,27.67) v1(26.08,26.9) v1(26.2,53.19) v1(26.25,42.61) v1(26.73,26.95) v1(26.8,52.56) v1(26.78,27.62) v1(26.92,53.21) v1(27.05,42.59) v1(26.99,15.68) v1(27.58,53.3) v1(27.6,52.56) v1(27.79,42.61) v1(28.26,53.23) v1(28.3,52.51) v1(28.96,53.26) v1(28.98,52.54) v1(32.62,27.77) v1(32.6,27.07) v1(32.6,26.39) v1(32.6,25.63) v1(32.58,25.02) v1(32.64,24.19) v1(32.64,23.66) v1(32.62,22.9) v1(33.36,27.71) v1(33.32,27.03) v1(33.34,25.59) v1(33.32,24.91) v1(33.32,24.21) v1(33.32,23.54) v1(33.34,22.92) v1(33.4,26.33) v1(37.32,50.76) v1(46.59,25.97) v1(46.59,25.38) v1(47.24,26.08) v1(47.37,25.34) v1(47.96,25.42) v1(48.03,26.03) v1(48.64,26.03) v1(48.64,25.4) v1(49.4,25.97) v1(49.45,25.4) v1(50.08,26.01) v1(50.1,25.36) v1(50.65,62.27) v1(50.69,61.55) v1(50.71,60.92) v1(50.67,60.16) v1(50.69,59.48) v1(50.71,58.82) v1(51.37,62.25) v1(51.37,61.47) v1(51.39,60.77) v1(51.39,60.03) v1(51.39,59.5) v1(51.41,58.72) v1(54.21,67.35) v1(54.19,66.72) v1(54.86,67.33) v1(54.93,66.7) v1(55.58,67.33) v1(58.21,44.51) v1(60.48,22.91) v1(62.65,31.18) v1(62.65,22.63) v1(65.83,22.56) v1(66.87,62.23) v1(66.91,61.55) v1(66.91,60.11) v1(66.93,59.44) v1(66.93,58.7) v1(66.97,60.81) v1(67.46,37.42) v1(67.63,62.27) v1(67.63,61.51) v1(67.63,60.88) v1(67.63,60.2) v1(67.63,59.52) v1(67.63,58.76) v1(69.77,22.56) v1(70.97,34.73) v1(72.96,28.64) v1(74.06,22.56) v1(74.7,29.4) v1(77.03,68.37) v1(77.03,67.65) v1(77.43,36.53) v1(77.39,35.77) v1(77.62,68.37) v1(77.72,67.63) v1(77.68,24.24) v1(77.81,22.58) v1(78.3,68.37) v1(78.3,67.65) v1(79.57,28.64) v1(81.09,22.54) v1(81.39,35.52) v1(81.41,34.78) v1(82.11,35.45) v1(82.17,34.76) v1(82.87,35.45) v1(82.89,34.69) v1(83.33,27.47) v1(83.71,62.15) v1(83.71,61.4) v1(83.67,60.75) v1(83.73,60.03) v1(83.73,59.33) v1(83.73,58.7) v1(84.39,62.17) v1(84.41,61.4) v1(84.43,60.69) v1(84.43,60.01) v1(84.41,59.29) v1(84.48,58.65)
UNNAMEDNET4: length 269.5
  Top Layer w0.253: 65.88,47.81 66.89,47.81 67.84,48.76 ; 49.04,47.82 50.63,47.82 51.42,48.61 51.72,48.61 52.92,47.41 55.08,47.41 55.9,46.59 55.9,46.52 55.93,15.63 56.73,14.84 56.73,13.11 ; 74.19,48.58 72.67,48.58 71.68,47.59 69.32,47.59 68.21,48.7 ; 57.57,48.6 56.28,48.6 55.14,47.46 ; 50.2,67.35 49.19,67.35 44.69,62.85 44.69,62.76 ; 84.29,48.6 83.35,47.67 82.34,47.67 ; 84.55,24.32 84.5,24.32 83.96,24.86 83.4,24.86 ; 56.74,13.75 79.11,13.68 80.67,13.68 ; 81.46,26.89 81.46,25.27 81.87,24.86 83.02,24.86 83.08,24.92
  Top Layer w0.913: 24.06,24.02 24.06,24.28 ; 21.4,23.23 23.65,23.23 ; 24.19,23.99 28.8,23.99
  Top Layer w0.938: 12.3,28.44 13.65,27.08 21.25,27.08 24.06,24.28
  Top Layer w0.964: 23.96,21.65 23.98,21.67 23.98,23.66
  Bottom Layer w0.253: 57.81,48.59 67.66,48.59 67.99,48.92 67.99,54.99 70.43,57.44 70.43,57.64 69.28,58.79 69.28,61.31 71.82,63.85 76.01,63.85 77.3,62.56 ; 53.91,62.61 53.91,62.71 50.14,66.47 50.14,67.25 ; 74.42,48.63 83.88,48.63 84.54,49.29 84.54,54.96 87.02,57.44 87.02,57.5 85.78,58.74 85.78,61.23 86.83,62.28 86.94,62.28 ; 60.73,62.59 59.55,63.76 55.47,63.76 52.9,61.19 52.9,58.67 54.04,57.53 54.04,57.32 51.6,54.89 51.6,48.87
  Bottom Layer w0.278: 80.72,13.75 80.72,15.47 83.65,18.4 83.65,23.4 84.52,24.27
  Bottom Layer w0.557: 44.53,14.22 44.43,14.12 29.46,14.08 29.05,13.66 29.05,12.44 ; 23.67,13.88 29.04,13.88 29.07,13.84 ; 56.72,13.02 56.18,12.48 46.59,12.48 44.93,14.14 44.93,16.65
  Bottom Layer w0.964: 19.04,27.08 19.04,20.55 23.28,16.31 23.28,12.77 23.31,12.74
  vias: v1(50.19,67.35) v1(56.77,13) v1(57.72,48.58) v1(74.25,48.56) v1(80.73,13.69) v1(84.54,24.3)
UNNAMEDNET5: length 41.4
  Top Layer w0.253: 65.18,32.69 66.92,32.69 67.77,33.54 67.77,34.07
  Bottom Layer w0.253: 67.86,33.98 68.76,33.98 77.24,25.51 90.9,25.51 92.73,23.67 92.73,15.08 92.58,14.93
  vias: v1(67.8,33.95)
UNNAMEDNET6: length 42
  Top Layer w0.253: 65.25,30.15 66.04,30.15
  Bottom Layer w0.253: 89.94,15.11 89.95,15.11 92.05,17.22 92.05,23.54 90.59,25 76.8,25 75.27,26.53 65.98,26.53 64.28,28.23 64.28,29.41 64.97,30.1
  vias: v1(65.05,30.16)
UNNAMEDNET7: length 173
  Top Layer w0.253: 72.17,21.75 72.17,22.7 ; 79.71,21.75 79.71,23.21 ; 71.71,30.13 72.59,30.13 74.93,27.79 76.16,27.79 78.78,25.17 78.78,23.36 ; 28.61,19.97 30.42,19.97 ; 75.87,40.75 74.91,40.75 74.6,40.44 74.6,36.05 74.25,35.7 73.87,35.7 ; 76.11,23.33 76.11,24.36 ; 68.67,33.7 68.66,33.71 68.66,35.63 ; 60.61,21.93 62.02,23.34 66.15,23.34 66.72,22.77 68.87,22.77 69.43,23.33 70.04,23.33 70.58,22.79 72.82,22.79 73.3,23.26 81.92,23.26 83.42,21.76 83.48,21.76 ; 66.02,38.77 64.59,38.77 62.07,41.29 60.91,41.29 59.83,42.36 59.83,42.86 61.38,44.42 61.76,44.42 ; 75.89,21.86 75.89,23.16 ; 24.09,19.44 24.29,19.44 ; 61.39,27.73 61.32,27.8 61.32,30.12 61.46,30.26 63.5,30.26 64.55,31.31 64.55,31.66 64.58,31.69 66.69,31.69 68.63,33.63 70.09,33.63 71.61,32.12 71.61,30.15 ; 30.41,19.88 29.83,19.3 29.83,18.57 ; 87.14,14.65 87.14,17.97 86.73,18.38 83.08,18.38 82.83,18.64 82.8,18.64 ; 68.36,21.89 68.36,22.67 ; 64.54,21.76 64.54,23.25 ; 66.09,38.62 66.09,37.49 67.87,35.71 72.55,35.71
  Top Layer w0.278: 24.29,19.44 26.08,21.23 27.88,21.23 28.42,20.69 28.42,20.2
  Top Layer w0.938: 15.33,22.64 17.1,22.64 18.64,21.1 18.64,19.52 19.07,19.08 23.45,19.08 ; 17.05,22.68 17.05,22.92 ; 21.56,19.4 21.56,21.55
  Top Layer w0.964: 53.28,24.91 53.28,27.7 54.54,28.96
  Bottom Layer w0.278: 82.76,18.71 82.76,22.42 81.88,23.29 78.83,23.29
  Bottom Layer w0.964: 21.69,21.73 23.1,21.73 51.34,21.78 53.28,23.72 53.28,24.75 56.39,27.87 61.44,27.87
  vias: v1(61.46,27.79) v1(78.76,23.26) v1(82.8,18.69)
UNNAMEDNET8: length 211
  Top Layer w0.253: 88.58,22.56 95.75,22.56 97.5,24.32 97.53,24.32 99.08,25.88 99.08,50.28 98.19,51.17 97.79,51.17 ; 79.57,26.98 79.57,26.06 81.8,23.82 83.54,23.82 84.83,22.54 88.03,22.54 ; 36.34,48.81 36.87,48.81 39.67,46.02 55.04,46.02 55.39,45.67 55.39,31.56 55.09,31.25 ; 25.86,14.72 30.74,14.72 31.61,13.85 31.61,12.46 ; 97.58,42.8 98.32,42.8 99.07,42.05
  Bottom Layer w0.278: 25.77,14.8 25.77,15.88 20.48,21.17 20.48,26.78 22.34,28.64 52.4,28.64 54.98,31.22 55.05,31.22 ; 89.47,22.51 88.33,21.37 88.33,12.91 86.57,11.16 32.66,11.16 32.06,11.76 32.06,11.87
  vias: v1(25.78,14.7) v1(55.08,31.22) v1(89.56,22.58)
UNNAMEDNET9: length 32.7
  Top Layer w0.253: 87.03,43.8 87.13,43.8 88.14,42.8 88.14,40.6 88.67,40.07 90.39,40.07 91.34,41.02 91.34,61.2 90.28,62.27
  Bottom Layer w0.253: 87.23,60.13 89.42,62.33 89.81,62.33
UNNAMEDNET10: length 33.8
  Top Layer w0.253: 90.46,64.71 90.46,64.64 91.96,63.14 91.96,40.47 90.97,39.49 88.15,39.49 86.91,40.72 86.91,41.19
  Bottom Layer w0.253: 87.6,65.09 90.14,65.09
UNNAMEDNET11: length 47.4
  Top Layer w0.253: 73.42,62.58 72.23,63.76 72.23,66.08 72.52,66.37 74.49,66.37 75.44,65.42 75.44,46.7 74.35,45.61 72.46,45.61 72.23,45.38 ; 72.15,44.46 72.15,45.23
  Bottom Layer w0.253: 84.22,44.24 83.08,45.38 72.26,45.38 ; 73.13,62.34 73.13,62.15 70.44,59.46
  vias: v1(72.16,45.32)
UNNAMEDNET12: length 42.2
  Top Layer w0.253: 70.15,44.59 70.15,45.47 ; 70.08,45.58 70.64,46.14 74.07,46.14 74.92,46.99 74.92,63.64 73.99,64.57 73.92,64.57
  Bottom Layer w0.253: 70.94,65.08 73.17,65.08 ; 70.11,45.58 71.14,44.56 81.34,44.56 84.11,41.79 84.11,41.75
  vias: v1(70.12,45.51)
UNNAMEDNET13: length 39.8
  Top Layer w0.253: 68.15,44.7 68.15,45.19 67.25,46.09 59.83,46.09 58.95,46.97 58.95,65.38 57.96,66.37 56.08,66.37 55.64,65.92 55.64,63.89 56.67,62.85 56.76,62.85
  Bottom Layer w0.253: 56.76,62.56 54.38,60.18 54.38,60.05
UNNAMEDNET14: length 29.6
  Top Layer w0.253: 57.35,64.73 58.33,63.74 58.33,46.75 59.47,45.61 65.74,45.61 66.1,45.25 66.1,44.77
  Bottom Layer w0.253: 54.26,65.02 56.62,65.02
UNNAMEDNET15: length 353.8
  Top Layer w0.253: 12.02,68.91 12.02,69.05 11.54,69.53 8.55,69.53 7.82,70.26 7.82,70.93 ; 5.61,50.01 3.52,47.92 3.52,34.51
  Top Layer w0.938: 53.61,72.71 53.61,68.9 49.09,64.37 49.09,64.3 45.97,61.19 45.97,48.87 44.51,47.41 ; 77.41,47.33 79.04,48.96 79.04,59.77 82.27,63.01 82.27,64.5 80.86,65.91 80.86,71.61 79.59,72.88 58.31,72.96 27.26,72.96 26.2,71.9 16.55,71.9 13.06,68.41 ; 21.29,69.91 21.29,71.75 ; 53.85,68.9 53.87,68.88 56.92,68.88 59.18,66.61 63.65,66.61 65.49,64.77 65.49,64.33 62.4,61.23 62.4,48.83 61.02,47.46
  Top Layer w1.929: 14.62,48.59 14.62,48.72 12.87,50.46 6,50.46 2.49,53.97 2.49,54.31 5.84,57.67 5.84,63.9 7.34,65.41 11.58,65.41 12.88,66.71 12.88,68.08 ; 14.21,47.09 14.21,48.41
  Top Layer w1.954: 89.93,17.14 93.08,17.14 94.84,18.9 97.3,18.9
  Bottom Layer w1.954: 90.04,9.53 94.4,13.89 94.4,16.11 97.26,18.97
  Bottom Layer w2.437: 90.08,9.53 14.61,9.53 12.72,11.41 12.72,35.33 14.16,36.77 14.16,46.91
UNNAMEDNET16: length 12.4
  Bottom Layer w0.557: 43.41,70.7 43.49,70.7 46.04,68.15 46.04,61.65 44.48,60.09
UNNAMEDNET17: length 14.7
  Bottom Layer w0.557: 44.57,57.53 44.57,57.64 46.94,60.01 46.94,69.86 45.95,70.84
UNNAMEDNET18: length 17.1
  Bottom Layer w0.557: 44.63,55.18 47.84,58.39 47.84,70.44 48.14,70.75 48.24,70.75
UNNAMEDNET19: length 20.8
  Bottom Layer w0.557: 50.89,70.87 49.12,69.09 49.12,57.16 44.63,52.67 44.63,52.62
UNNAMEDNET20: length 36.5
  Top Layer w0.253: 73.29,47.06 72.88,46.65 63.66,46.65 63.28,46.86 ; 89.86,47.03 89.34,46.51 79.8,46.51 79.25,47.06 79.25,47.28 ; 63.29,44.52 63.62,44.52
  Bottom Layer w0.253: 63.12,44.66 63.12,46.73 ; 73.71,47.25 73.71,47.19 74.82,46.08 77.92,46.08 79.2,47.35 ; 57.46,46.94 57.46,46.89 58.5,45.85 63.02,45.85
  vias: v1(63.12,44.53) v1(63.18,46.8) v1(79.29,47.37)
UNNAMEDNET21: length 2.1
  Top Layer w0.253: 57.05,57.35 57.05,59.47
UNNAMEDNET22: length 8.6
  Top Layer w0.253: 57,54.81 56.02,53.83 54.69,53.83 ; 49.15,53.81 50.5,55.16 52.77,55.16 53.8,54.13 53.8,53.9
UNNAMEDNET23: length 7.8
  Top Layer w0.253: 54.74,51.28 55.99,51.28 56.87,52.17 ; 53.87,51.52 52.85,52.54 50.48,52.54 49.64,51.69 49.35,51.69
UNNAMEDNET24: length 8
  Top Layer w0.253: 49.46,50.01 52.93,50.01 54.07,48.86 54.22,48.86 55.18,49.83 56.61,49.83
UNNAMEDNET25: length 37.9
  Top Layer w0.532: 77.47,70.7 77.43,70.7 74.35,67.62 59.87,67.62 56.9,70.59
  Bottom Layer w0.557: 60.84,60.02 62.95,62.12 62.95,65.49 59.05,69.38 58.1,69.38 56.77,70.72 56.77,70.89
UNNAMEDNET26: length 34.2
  Top Layer w0.532: 59.28,70.82 59.28,70.77 61.56,68.48 72.89,68.48 74.99,70.59
  Bottom Layer w0.557: 58.84,70.8 63.9,65.74 63.9,60.53 60.95,57.57 60.9,57.57
UNNAMEDNET27: length 31
  Top Layer w0.532: 61.54,70.58 62.84,69.28 71.97,69.28 72.47,69.79 72.47,70.58
  Bottom Layer w0.557: 60.82,54.95 64.74,58.86 64.74,66.16 61.71,69.18 61.71,70.56
UNNAMEDNET28: length 25
  Top Layer w0.532: 64.68,70.88 69.51,70.88
  Bottom Layer w0.557: 61.14,52.73 61.15,52.73 65.64,57.21 65.64,66.61 64.35,67.9 64.35,70.51
UNNAMEDNET29: length 1.7
  Top Layer w0.253: 73.52,57.78 73.52,59.47
UNNAMEDNET30: length 8.9
  Top Layer w0.253: 65.84,54 65.84,54.07 67.09,55.32 69.15,55.32 70.51,53.96 72.59,53.96 73.31,54.68
UNNAMEDNET31: length 8.8
  Top Layer w0.253: 65.93,51.94 66.11,51.94 ; 73.29,52 73.17,52 72.62,51.45 70.55,51.45 69.28,52.72 67.07,52.72 65.91,51.56
UNNAMEDNET32: length 7.9
  Top Layer w0.253: 65.92,50.2 69.24,50.2 70.29,49.14 70.74,49.14 71.42,49.82 73.09,49.82
UNNAMEDNET33: length 20.1
  Bottom Layer w0.557: 77.52,60.17 77.58,60.17 79.9,62.49 79.9,67.19 82,69.29 89.34,69.29 90.58,70.53
UNNAMEDNET34: length 21.5
  Top Layer w0.532: 88.46,68.33 88.46,70.81
  Bottom Layer w0.557: 88.38,68.39 82.35,68.39 80.78,66.82 80.78,60.83 77.43,57.48
  vias: v1(88.43,68.35)
UNNAMEDNET35: length 20.8
  Top Layer w0.532: 85.86,67.46 85.86,70.61
  Bottom Layer w0.557: 77.62,54.96 77.62,55.18 81.72,59.27 81.72,66.3 82.9,67.48 85.87,67.48
  vias: v1(85.85,67.44)
UNNAMEDNET36: length 20.5
  Top Layer w0.532: 83.17,66.44 83.17,70.71
  Bottom Layer w0.557: 83.16,66.45 82.59,65.88 82.59,57.59 82.52,57.52 77.52,52.57 77.51,52.57
  vias: v1(83.18,66.42)
UNNAMEDNET37: length 2
  Top Layer w0.253: 90.07,57.63 90.07,59.58
UNNAMEDNET38: length 8.5
  Top Layer w0.253: 89.67,54.48 89.05,53.86 87.06,53.86 85.76,55.16 83.64,55.16 82.48,54 82.44,54
UNNAMEDNET39: length 8.5
  Top Layer w0.253: 87.5,51.29 89.03,51.29 89.89,52.15 90.07,52.15 ; 87.01,51.48 86.94,51.48 85.81,52.61 83.57,52.61 82.4,51.45
UNNAMEDNET40: length 7.7
  Top Layer w0.253: 87.79,48.8 89.12,48.8 89.92,49.59 ; 86.88,49.01 86.88,49.02 85.81,50.09 82.53,50.09 82.24,49.81
UNNAMEDNET41: length 21.3
  Top Layer w0.253: 89.49,41.7 89.61,41.7 90.69,42.78 90.69,45.04 89.71,46.02 75.96,46.03 75.49,46.03 74.21,44.75
UNNAMEDNET42: length 14.5
  Top Layer w0.253: 89.67,44.28 88.46,45.5 76.6,45.5 76.06,44.96 76.06,44.75
UNNAMEDNET43: length 37.5
  Top Layer w0.253: 59.07,20.09 60.56,20.09 ; 61.62,14.88 59.26,14.88 59.3,14.92 59.27,14.95 59.27,19.69 58.91,20.05 ; 59.38,39.98 59.16,39.98 56.48,37.31 56.48,15.91 57.49,14.9 58.97,14.9
  vias: v1(59.29,18.56)
UNNAMEDNET44: length 39.2
  Top Layer w0.253: 64.2,20.11 62.79,20.11 62.75,20.07 ; 66.67,14.92 66.65,14.9 64.61,14.9 64.35,15.17 64.35,19.72 ; 59.71,38.09 59.03,38.09 56.98,36.04 56.98,16.61 56.99,16.59 57.45,16.14 57.5,16.14
  Bottom Layer w0.253: 57.57,16.17 63.16,16.17 64.16,15.18
  vias: v1(57.53,16.13)
UNNAMEDNET45: length 41.8
  Top Layer w0.253: 59.41,36.17 58.53,36.17 57.53,35.18 57.53,17.46 58,17 ; 71.69,14.9 69.46,14.9 68.37,15.99 68.37,19.82 ; 66.81,20.11 68.22,20.11
  Bottom Layer w0.253: 58.13,16.97 67.4,16.97 69.23,15.15 69.45,15.15
  vias: v1(58.04,16.98)
UNNAMEDNET46: length 64.6
  Top Layer w0.253: 70.57,20.1 71.96,20.1 ; 72.34,23.54 72.34,24.25 ; 74.35,15.17 74.27,15.17 72.15,17.29 72.15,19.91 ; 34.23,13.86 34.27,13.91 41.48,13.91 43.38,12 47.93,12 49.62,13.69 ; 34.13,12.14 34.13,19.59
  Top Layer w0.278: 32.48,20.09 33.63,20.09 34.13,19.59
  Bottom Layer w0.253: 72.09,18.85 72.09,23.02 72.28,23.21 72.28,23.31 ; 50.19,14.21 50.19,14.31 51.29,15.41 56.9,15.41 58.62,13.68 73.22,13.68 74.45,14.92
  vias: v1(72.18,18.82) v1(72.37,23.39)
UNNAMEDNET47: length 17.9
  Top Layer w0.253: 76.89,15.05 76.82,15.05 75.9,15.97 75.9,20.1 ; 70.34,24.16 70.91,23.59 ; 74.08,20.13 75.7,20.13
  Bottom Layer w0.253: 70.96,23.46 70.96,18.86 71.71,18.11 75.23,18.11 75.81,18.69
  vias: v1(70.99,23.5) v1(75.92,18.8)
UNNAMEDNET48: length 23.2
  Top Layer w0.253: 79.72,15.12 79.72,19.94 ; 78.04,20.09 79.62,20.09 ; 68.56,23.53 68.56,24.36
  Bottom Layer w0.253: 68.53,23.39 68.53,19.98 70.89,17.62 78.6,17.62 79.63,18.65 79.7,18.65
  vias: v1(68.56,23.43) v1(79.71,18.71)
UNNAMEDNET49: length 27
  Top Layer w0.253: 81.61,19.94 81.61,15.4 81.86,15.15 81.86,15.13 ; 67.18,23.44 67.15,23.44 66.66,23.93 66.66,24.37 ; 81.68,20.09 83.08,20.09
  Bottom Layer w0.253: 67.16,23.41 67.16,20.32 70.41,17.07 79.92,17.07 81.53,18.68 81.57,18.68
  vias: v1(67.2,23.37) v1(81.58,18.69)
UNNAMEDNET51: length 8.1
  Top Layer w1.903: 89.43,28.6 90.06,29.23
  Top Layer w1.929: 90.06,29.23 97.3,29.23
UNNAMEDNET52: length 169.8
  Top Layer w0.938: 83.43,30.01 83.7,30.01 85.7,32.01 87.45,32.01 88.23,32.8 88.23,34.29 ; 24.51,38.83 25.66,38.83 25.81,38.98
  Top Layer w0.964: 25.81,37.08 25.81,38.98
  Top Layer w0.989: 29.07,30.22 29.07,30.29 27.95,31.41 26.82,31.41 ; 28.78,28.69 28.82,28.65 28.82,27.05
  Top Layer w1.522: 97.24,67.25 95.67,67.25 94.59,66.17 94.59,38.23 95.21,37.61 97.11,37.61 97.28,37.44 97.28,32.05 ; 95.1,59.12 96.99,59.12 ; 88.29,34.67 96.77,34.67
  Top Layer w1.548: 48.44,31.08 48.5,31.08 ; 48.43,30.87 50.88,30.87 51.13,31.11 51.13,32.03 ; 29.1,29.42 29.1,30.05 32.06,33 46.54,33 48.07,31.46 48.07,29.21
  Bottom Layer w1.573: 50.31,31.45 27.09,31.41 24.49,34.02 24.49,38.9
  Bottom Layer w3.478: 50.3,31.42 61.16,42.28 78.55,42.28 82.58,38.25 84.7,38.25 88.25,34.69
UNNAMEDNET53: length 19.9
  Top Layer w0.253: 10.2,70.93 11.27,70.93
  Top Layer w1.929: 9.4,54.59 9.4,54.86 12.93,58.4 ; 16.89,67.82 16.89,62.42 15.54,61.07 15.54,60.98
  Bottom Layer w0.253: 16.61,68.5 14.27,70.83 11.43,70.83
  vias: v1(11.28,70.84)
UNNAMEDNET54: length 19.6
  Top Layer w1.929: 33.8,56.96 33.63,57.13 23.05,57.13 21.84,55.92 ; 37.66,60.75 37.61,60.79 37.61,67.78
UNNAMEDNET55: length 12.1
  Top Layer w1.929: 22.46,62.59 22.58,62.46 27.11,62.46 32.32,67.67
UNNAMEDNET57: length 20.4
  Bottom Layer w1.929: 9.04,59.35 6.98,57.3 6.98,44.68 8.53,43.14 11.2,43.14
UNNAMEDNET58: length 14.2
  Top Layer w1.929: 6.21,33.94 6.21,34.95 9.63,38.36 10.85,38.36 14.26,41.77 14.26,43.98
  Top Layer w1.954: 14.26,43.98 14.31,44.04
UNNAMEDNET61: length 24.8
  Top Layer w0.253: 8.45,24.58 6.72,24.58 5.38,23.24 5.38,21.28 6.8,19.85 6.91,19.85 ; 9.46,24.66 9.46,26.92 ; 11.04,20.71 11.04,19.35 10.89,19.2 10.29,19.2 9.15,18.07 9.15,14.44 10.02,13.57 10.74,13.57 ; 10.69,19.56 10.51,19.74 8.19,19.74
  Top Layer w0.278: 8.45,24.58 11.37,24.58
UNNAMEDNET64: length 82.5
  Top Layer w0.202: 7.27,22.02 6.37,22.02 6.1,22.3 6.1,22.78 6.33,23.01 13.55,23.01 14.26,22.3 14.26,16.22 14.76,15.72 25.16,15.72 25.56,16.12 25.56,17.92
  Top Layer w0.227: 59.69,26.48 59.71,26.5 62.81,26.5 64.99,28.68 ; 65.16,33.71 65.63,33.71 66.12,34.21
  Bottom Layer w0.202: 66.12,34.32 66.12,29.84 65.09,28.81 65.09,28.8
  Bottom Layer w0.227: v1(25.55,17.99) 25.55,18.52 26.85,19.82 54.82,19.82 57.05,22.06 57.05,24.64 58.9,26.48 59.46,26.48
  vias: v1(59.53,26.46) v1(65.02,28.74) v1(66.17,34.25)
UNNAMEDNET65: length 81.6
  Top Layer w0.202: 8.42,21.5 9.45,21.5 9.82,21.86 9.82,22.42 ; 66.82,33.58 66.46,33.22 65.06,33.22 ; 8.42,22.51 12.94,22.51 13.8,21.65 13.8,15.96 14.46,15.3 25.41,15.3 26.43,16.32 26.43,17.89 ; 12.86,21.17 13.73,21.17
  Top Layer w0.227: 65.53,28.04 63.24,25.74 60.25,25.74
  Bottom Layer w0.202: 66.84,33.67 66.84,29.39 65.64,28.18 65.64,28.16
  Bottom Layer w0.227: 26.48,18.13 26.48,18.18 27.64,19.35 55.21,19.35 57.64,21.77 57.64,24.43 58.93,25.72 59.95,25.72
  vias: v1(26.44,18.01) v1(60.13,25.72) v1(65.64,28.17) v1(66.84,33.63)
UNNAMEDNET68: length 260.4
  Top Layer w0.253: 48.33,35.39 48.51,35.39 ; 48.56,35.39 48.56,33.03 47.9,33.77 47.34,34.33 46.62,34.55
  Top Layer w0.38: 48.33,35.39 48.4,33.47
  Top Layer w0.43: 33.27,42.47 34.88,42.3 34.69,42.74 33.57,42.63 34.68,43.66 34.61,43 34.18,42.81 35.35,44.37 36.17,44.96 35.97,44.99 38.98,44.99 39.17,44.95 36.66,44.47 35.7,44.26 36.33,44.76 36.47,44.58 ; 34.94,34.86 34.17,34.86 33.37,35.67 34.62,35.2 34.37,35.25 34.66,35.53 33.32,35.74 ; 48.4,33.47 47.6,34.54 48,34.32 48.09,34.14 ; 34.83,34.55 33.99,34.55 32.96,35.59 32.96,42.39 35.99,45.42 39.05,45.42 40.16,44.31 40.16,44.06
  Top Layer w1.548: 37.89,44.34 35.41,46.82 26.1,46.82 25.67,47.24
  Bottom Layer w0.253: 44.83,45.82 44.62,46.03 44.14,46.03 43.92,45.8
  Bottom Layer w0.557: 31.57,32.92 31.61,33.07 ; 31.53,33.07 29.15,35.45 29.15,42.86 31.99,45.71 36.05,45.71 53.88,45.73 54.83,44.78 54.83,39.41 48.37,32.91 31.73,32.91 31.59,33.05
  Bottom Layer w1.141: 53.4,40.41 48.03,34.67 48.39,45.02 53.78,44.89 54.14,44.45 54.33,39.88 48.28,33.7 47.9,34.33 ; 32.13,45.06 29.87,42.57 29.78,35.81 31.86,33.55 31.96,43.86 31.07,43.24 31.05,35.35 30.35,36.13 30.88,42.4
  Bottom Layer w1.319: 53.02,44.11 53.09,40.45
  Bottom Layer w1.37: 49.25,44.43 50.29,43.05 48.92,41.23 49.45,43.96 51.24,43.94 50.86,41.13 48.37,39.22 51.86,43.88 52.24,43.88 48.66,38.23 52.18,40.24 48.66,36.58 51.71,40.41 53.02,44.11
  vias: v1(33.15,41.55) v1(33.1,39.14) v1(33.13,38.38) v1(33.17,42.42) v1(33.21,40.85) v1(33.19,39.96) v1(33.19,37.57) v1(33.21,36.77) v1(33.87,39.14) v1(33.93,42.33) v1(33.93,41.51) v1(33.91,40.83) v1(33.93,39.9) v1(33.93,38.42) v1(33.89,37.53) v1(33.97,36.68) v1(46.14,40.41) v1(46.21,41.93) v1(46.21,41.13) v1(46.21,39.6) v1(46.23,38.78) v1(46.23,37.99) v1(46.25,37.08) v1(47.03,41.95) v1(47.01,41.11) v1(47.03,40.41) v1(46.99,39.52) v1(47.03,38.73) v1(47.01,37.91) v1(46.97,37.13) v1(47.79,41.95) v1(47.82,41.13) v1(47.82,40.32) v1(47.82,39.5) v1(47.86,38.82) v1(47.79,37.91) v1(47.84,37.11) v1(48.56,41.99) v1(48.54,41.19) v1(48.56,40.34) v1(48.56,39.48) v1(48.54,38.8) v1(48.54,37.87) v1(48.58,37.11) v1(49.25,41.21) v1(49.3,42.08) v1(49.28,40.41) v1(49.34,39.52) v1(49.32,38.65) v1(49.28,37.91) v1(49.32,37.06) v1(50.08,41.99) v1(50.1,41.13) v1(50.08,40.32) v1(50.14,39.48) v1(50.14,38.71) v1(50.12,37.95) v1(50.1,37.08) v1(50.86,40.34) v1(50.93,41.8) v1(50.91,41.08) v1(50.95,37.06) v1(50.97,39.43) v1(50.99,38.65) v1(50.99,37.89) v1(51.75,41.11) v1(51.67,40.3) v1(51.67,39.54) v1(51.69,38.69) v1(51.75,37.95) v1(51.69,37.08) v1(51.77,41.91) v1(52.37,41.93) v1(52.45,41.13) v1(52.39,40.32) v1(52.41,38.71) v1(52.43,37.95) v1(52.47,39.45) v1(53.19,41.97) v1(53.23,41.15) v1(53.23,40.34) v1(53.17,39.54) v1(53.21,38.76)
UNNAMEDNET69: length 28.8
  Top Layer w0.938: 26,33.53 25.92,33.61 25.92,35.05
  Top Layer w1.548: 30.52,35.47 30.52,34.77 29.1,33.35 10.56,33.35 6.5,29.28 6.22,29.28
UNNAMEDNET70: length 4.2
  Top Layer w0.583: 30.05,37.61 29.17,37.61 28.71,37.16 28.71,35.61 28.24,35.14 27.8,35.14
UNNAMEDNET71: length 6.6
  Top Layer w0.938: 27.39,37.09 27.39,40.79 27.56,40.96 30.18,40.96
UNNAMEDNET72: length 42.2
  Top Layer w0.253: 27.79,49.68 28.92,48.55 34.15,48.55 34.33,48.73 34.33,50.41
  Top Layer w0.938: 27.65,50.41 27.52,50.41 26.72,51.2 15.43,51.2 13.52,53.12 12.41,53.12 12.41,53.48 14.35,55.41 17.35,55.41 18.43,56.49 18.43,57.71 20.56,59.85 25.76,59.85
UNNAMEDNET73: length 1.6
  Top Layer w0.253: 86.43,20.92 88.01,20.92
UNNAMEDNET75: length 9.7
  Top Layer w0.253: 73.82,33.7 79.7,33.7 ; 80.32,32.52 80.59,32.52 ; 83.11,31.95 81.24,31.95 80.16,33.03 80.03,33.03
UNNAMEDNET76: length 16.2
  Top Layer w0.253: 79.8,42.48 79.8,36.72 77.3,34.23 73.78,34.23 ; 79.91,38.11 83.27,38.11
UNNAMEDNET78: length 5.2
  Top Layer w0.253: 77.72,29.17 77.72,30.75 78.01,31.04 80.14,31.04 80.55,30.63 80.55,30.15
UNNAMEDNET79: length 1.4
  Top Layer w0.202: 12.68,17.56 12.68,18.91
UNNAMEDNET80: length 82.2
  Top Layer w0.253: 12.65,13.71 12.65,15.29 ; 12.67,15.45 13.42,14.7 24.28,14.7 24.32,14.74 ; 68.61,36.5 68.58,36.53 68.58,38.49
  Bottom Layer w0.278: 24.35,14.71 24.35,16.54 19.98,20.91 19.98,27.09 21.99,29.1 51.77,29.1 59.1,36.43 68.54,36.43
  vias: v1(24.34,14.71) v1(68.58,36.36)
